# EAGLE schematic BEP32_12nutzen_90Grad (EAGLE 6.4), part 3 of 4
## Sheet 9 of 12
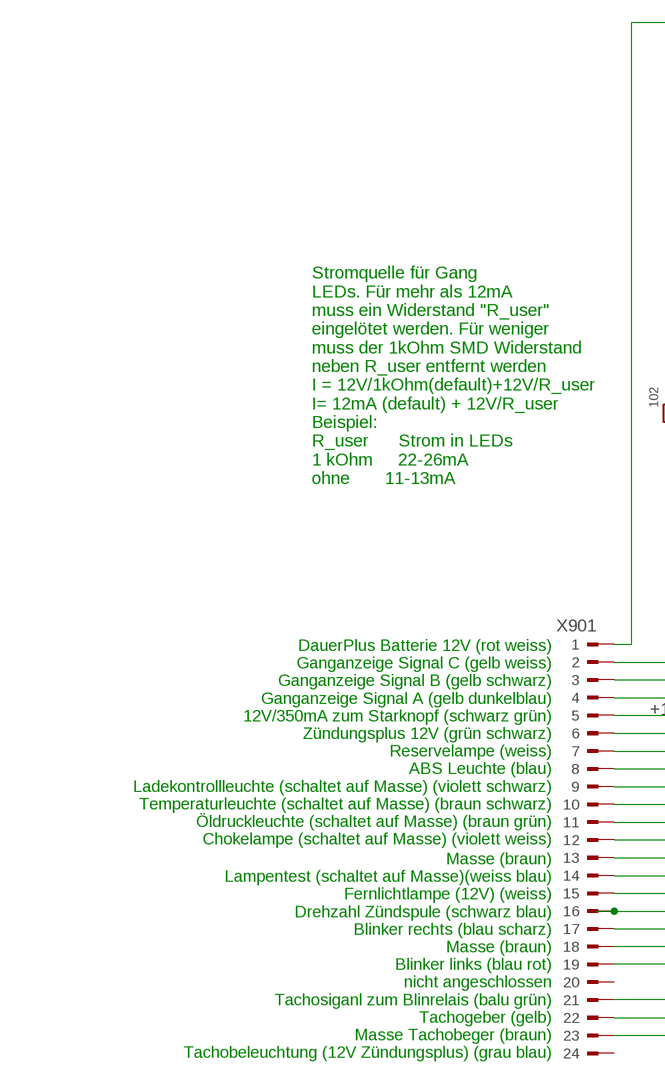
[diagram p16: schematic, sheet 9, part 1 of 2]
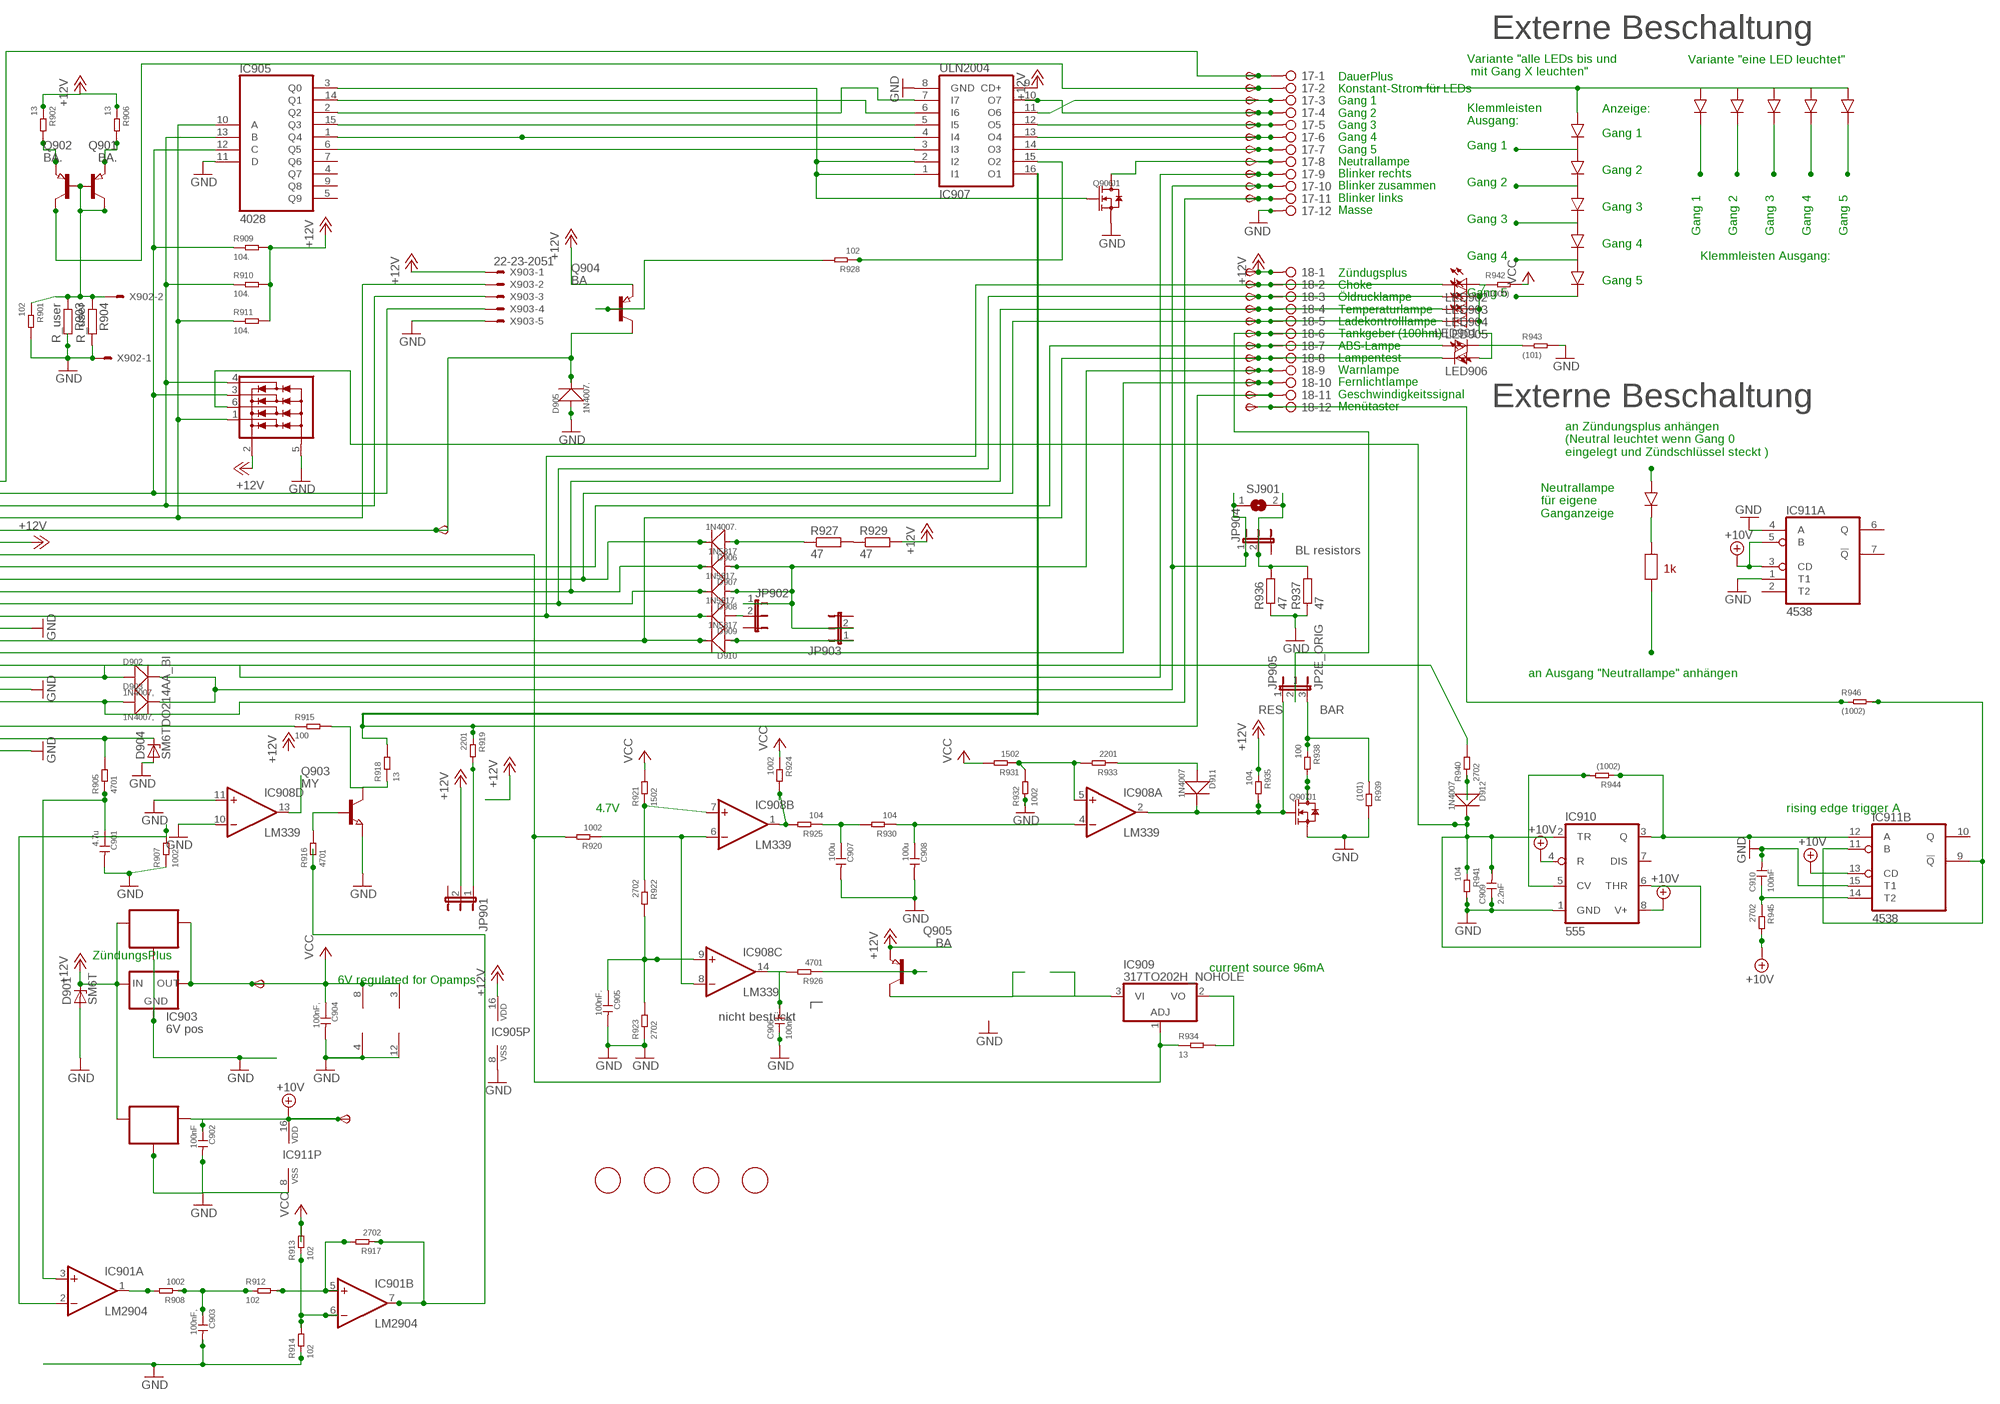
[diagram p17: schematic, sheet 9, part 2 of 2]

### Parts
6V901  TPSB2.0  [B2.0]
10V901  TPSB2.0  [B2.0]
17  2081-1132  [12-PIN]
18  2081-1132  [12-PIN]
C901  4.7u  CERAMIC-4.7UF-25V-10%-X5R(0805)  [C0805]
C902  100nF  CERAMIC-100NF-50V-10%-X7R(0805)  [C0805]
C903  100nF,  CERAMIC-100NF-50V-10%-X7R(0805)  [C0805]
C904  100nF,  CERAMIC-100NF-50V-10%-X7R(0805)  [C0805]
C905  100nF.  CERAMIC-100NF-50V-10%-X7R(0805)  [C0805]
C906  100nF.  CERAMIC-100NF-50V-10%-X7R(0805)  [C0805]
C907  100u  CERAMIC-100UF-6.3V-20%-X5R(1206)  [C1206]
C908  100u  CERAMIC-100UF-6.3V-20%-X5R(1206)  [C1206]
C909  2.2nF  CERAMIC-100NF-50V-10%-X7R(0805)  [C0805]
C910  100nF  CERAMIC-100NF-50V-10%-X7R(0805)  [C0805]
D901  SM6T  [DO214AA]
D902  1N4007,  DIODE-GEN-PURPOSE-1KV-1A(DO-214AC)  [DO-214AC]
D903  1N4007,  DIODE-GEN-PURPOSE-1KV-1A(DO-214AC)  [DO-214AC]
D904  SM6TDO214AA_BI  [DO214AA_BI]
D905  1N4007.  DIODE-GEN-PURPOSE-1KV-1A(DO-214AC)  [DO-214AC]
D906  1N4007.  DIODE-GEN-PURPOSE-1KV-1A(DO-214AC)  [DO-214AC]
D907  1N5817  DIODE-GEN-PURPOSE-1KV-1A(DO-214AC)DO-214AC/1206  [DO-214AC_SLIM]
D908  1N5817.  DIODE-GEN-PURPOSE-1KV-1A(DO-214AC)DO-214AC/1206  [DO-214AC_SLIM]
D909  1N5817.  DIODE-GEN-PURPOSE-1KV-1A(DO-214AC)DO-214AC/1206  [DO-214AC_SLIM]
D910  1N5817  DIODE-GEN-PURPOSE-1KV-1A(DO-214AC)DO-214AC/1206  [DO-214AC_SLIM]
D911  1N4007  DIODE-GEN-PURPOSE-1KV-1A(DO-214AC)  [DO-214AC]
D912  1N4007  DIODE-GEN-PURPOSE-1KV-1A(DO-214AC)  [DO-214AC]
FID901  FIDUCIAL  [FIDUCIAL_1MM]
FID902  FIDUCIAL  [FIDUCIAL_1MM]
FID903  FIDUCIAL  [FIDUCIAL_1MM]
FID904  FIDUCIAL  [FIDUCIAL_1MM]
IC901  LM2904  LM358D  [SO08]
IC902  78L06  78LXXSOT89_ROUND  [SOT89_ROUND]
IC903  6V pos  78LXX  [78LXX]
IC904  78L10  78LXXSOT89_ROUND  [SOT89_ROUND]
IC905  4028  4028D  [SO16]
IC906  NUP4304SOT457_R  [SOT457R_PHILIPS]
IC907  ULN2004  ULN2004AD  [SO16]
IC908  LM339  LM339D  [SO14]
IC909  317TO202H_NOHOLE  [TO220H_NOHOLE]
IC910  555  NE555D  [SO08]
IC911  4538  4538D  [SO16]
JP901  JP2EJP2_SMALLPADS  [JP2_SMALLPADS]
JP902  JP2EJP2_SMALLPADS  [JP2_SMALLPADS]
JP903  JP2EJP2_SMALLPADS  [JP2_SMALLPADS]
JP904  JP2EJP2_SMALLPADS  [JP2_SMALLPADS]
JP905  JP2E_ORIG  [JP2_ORIG_SMALLPADS]
LED901  LEDLD260  [LD260]
LED902  LEDLD260  [LD260]
LED903  LEDLD260  [LD260]
LED904  LEDLD260  [LD260]
LED905  LEDLD260  [LD260]
LED906  LEDLD260  [LD260]
Q901  BA.  PNP-TRANSISTOR_SOT89  [SOT89]
Q902  BA.  PNP-TRANSISTOR_SOT89  [SOT89]
Q903  MY  NPN-TRANSISTOR_SOT89  [SOT89]
Q904  BA  PNP-TRANSISTOR_SOT89  [SOT89]
Q905  BA  PNP-TRANSISTOR_SOT89  [SOT89]
Q906  J1  SMD-MOSFET-N-CH-50V-200MA-BSS138W-7-F(SOT-23)  [SOT-23]
Q907  J1  SMD-MOSFET-N-CH-50V-200MA-BSS138W-7-F(SOT-23)  [SOT-23]
R901  102  SMD-RES-1K-5%-1/8W(0805)  [R0805]
R902  13  SMD-RES-13R-5%-1/4W(1206)  [R1206]
R903  R_user  R-EU_R0805  [R0805]
R904  R_user  R-EU_R0805  [R0805]
R905  4701  SMD-RES-4.7K-5%-1/8W(0805)  [R0805]
R906  13  SMD-RES-13R-5%-1/4W(1206)  [R1206]
R907  1002  SMD-RES-10K-1%-1/8W(0805)  [R0805]
R908  1002  SMD-RES-10K-1%-1/8W(0805)  [R0805]
R909  104.  SMD-RES-10K-1%-1/8W(0805)  [R0805]
R910  104.  SMD-RES-10K-1%-1/8W(0805)  [R0805]
R911  104.  SMD-RES-10K-1%-1/8W(0805)  [R0805]
R912  102  SMD-RES-1K-5%-1/8W(0805)  [R0805]
R913  102  SMD-RES-1K-5%-1/8W(0805)  [R0805]
R914  102  SMD-RES-1K-5%-1/8W(0805)  [R0805]
R915  100  SMD-RES-220R-5%-1/8W(0805)  [R0805]
R916  4701  SMD-RES-4.7K-5%-1/8W(0805)  [R0805]
R917  2702  SMD-RES-4.7K-5%-1/8W(0805)  [R0805]
R918  13  SMD-RES-13R-5%-1/4W(1206)  [R1206]
R919  2201  SMD-RES-2.2K-5%-1/8W(0805)  [R0805]
R920  1002  SMD-RES-10K-1%-1/8W(0805)  [R0805]
R921  1502  SMD-RES-10K-1%-1/8W(0805)  [R0805]
R922  2702  SMD-RES-4.7K-5%-1/8W(0805)  [R0805]
R923  2702  SMD-RES-4.7K-5%-1/8W(0805)  [R0805]
R924  1002  SMD-RES-10K-1%-1/8W(0805)  [R0805]
R925  104  SMD-RES-10K-1%-1/8W(0805)  [R0805]
R926  4701  SMD-RES-4.7K-5%-1/8W(0805)  [R0805]
R927  47  R-EU_V235/17_1MM  [V235/17_1MM]
R928  102  SMD-RES-1K-5%-1/8W(0805)  [R0805]
R929  47  R-EU_V235/17_1MM  [V235/17_1MM]
R930  104  SMD-RES-10K-1%-1/8W(0805)  [R0805]
R931  1502  SMD-RES-10K-1%-1/8W(0805)  [R0805]
R932  1002  SMD-RES-10K-1%-1/8W(0805)  [R0805]
R933  2201  SMD-RES-2.2K-5%-1/8W(0805)  [R0805]
R934  13  SMD-RES-13R-5%-1/4W(1206)  [R1206]
R935  104.  SMD-RES-10K-1%-1/8W(0805)  [R0805]
R936  47  R-EU_V235/17_1MM  [V235/17_1MM]
R937  47  R-EU_V235/17_1MM  [V235/17_1MM]
R938  100  SMD-RES-2.2K-5%-1/8W(0805)  [R0805]
R939  (101)  SMD-RES-2.2K-5%-1/8W(0805)  [R0805]
R940  2702  SMD-RES-10K-1%-1/8W(0805)  [R0805]
R941  104  SMD-RES-10K-1%-1/8W(0805)  [R0805]
R942  (1000)  SMD-RES-100R-5%-1/8W(0805)  [R0805]
R943  (101)  SMD-RES-100R-5%-1/8W(0805)  [R0805]
R944  (1002)  SMD-RES-10K-1%-1/8W(0805)  [R0805]
R945  2702  SMD-RES-4.7K-5%-1/8W(0805)  [R0805]
R946  (1002)  SMD-RES-4.7K-5%-1/8W(0805)  [R0805]
SJ901  SJ  [SJ]
START901  TPSB2.0  [B2.0]
TP185  TPSB2.0  [B2.0]
TP186  TPSB2.0  [B2.0]
TP187  TPSB2.0  [B2.0]
TP188  TPSB2.0  [B2.0]
TP189  TPSB2.0  [B2.0]
TP190  TPSB2.0  [B2.0]
TP191  TPSB2.0  [B2.0]
TP192  TPSB2.0  [B2.0]
TP193  TPSB2.0  [B2.0]
TP194  TPSB2.0  [B2.0]
TP195  TPSB2.0  [B2.0]
TP196  TPSB2.0  [B2.0]
TP197  TPSB2.0  [B2.0]
TP198  TPSB2.0  [B2.0]
TP199  TPSB2.0  [B2.0]
TP200  TPSB2.0  [B2.0]
TP201  TPSB2.0  [B2.0]
TP202  TPSB2.0  [B2.0]
TP203  TPSB1,27  [B1,27]
TP204  TPSB2.0  [B2.0]
TP205  TPSB2.0  [B2.0]
TP206  TPSB2.0  [B2.0]
TP207  TPSB2.0  [B2.0]
X901  CON_BMWV2  [24-PIN_V2]
X902  22-23-2021  [22-23-2021]
X903  22-23-2051  [22-23-2051]

### Nets
+10V: 10V901.TP(PP) C902.1 IC904.1(OUT) IC910.4(R) IC910.8(V+) IC911.3(A:CD) IC911.5(A:B) IC911.13(B:CD) IC911.16(P:VDD) R945.2 ; also sheet 1,2,3,4,5,6,7,8,10,11,12
+12V: 18.1 D901.C IC902.3(IN) IC903.IN IC904.3(IN) IC905.16(VDD) IC906.2(V+) IC907.9(CD+) JP901.2 Q904.3(E) Q905.3(E) R902.1 R906.1 R909.2 R910.2 R911.2 R929.2 R935.1 TP206.TP(PP) X901.6 X903.1 ; also sheet 1,2,3,4,5,6,7,8,10,11,12
+12V9: IC901.7(B:OUT) R916.1 R917.1
GND: 17.12 C901.2 C902.2 C903.2 C904.2 C905.2 C906.1 C907.2 C908.2 C909.1 C910.2 D901.A D904.A D905.1(+) IC901.4(P:V-) IC902.2(GND) IC902.2@1(GND) IC903.GND IC904.2(GND) IC904.2@1(GND) IC905.8(VSS) IC905.11(D) IC906.5(V-) IC907.8(GND) IC908.10(D:-IN) IC908.11(D:+IN) IC908.12(P:GND) IC910.1(GND) IC911.1(A:T1) IC911.4(A:A) IC911.8(P:VSS) IC911.15(B:T1) Q903.3(E) Q906.2(S) Q907.2(S) R901.2 R903.2 R904.2 R907.1 R914.1 R923.1 R932.1 R936.1 R937.1 R939.2 R941.2 R943.2 X901.13 X901.18 X901.23 X902.1 X903.5 ; also sheet 1,2,3,4,5,6,7,8,10,11,12
N$779: R927.2 R929.1
N$780: 18.9 D907.1(+) D908.1(+) JP902.1 JP903.2 TP203.TP(PP)
N$781: IC905.10(A) IC906.1(D1) R911.1 X901.4 X903.2
N$782: IC905.13(B) IC906.4(D4) R910.1 X901.3 X903.3
N$783: D905.2(-) Q904.2(C) START901.TP(PP) X901.5
N$784: IC905.12(C) IC906.3(D3) R909.1 X901.2 X903.4
N$785: 18.7 LED901.A TP201.TP(PP) X901.8
N$786: 18.2 D909.2(-) LED902.K(C) TP196.TP(PP) X901.12
N$787: 18.3 D908.2(-) LED903.K(C) TP197.TP(PP) X901.11
N$788: 18.4 D907.2(-) LED904.K(C) TP198.TP(PP) X901.10
N$789: 18.8 D910.2(-) LED906.K(C) TP202.TP(PP) X901.14
N$790: 17.9 D902.1(+) TP193.TP(PP) X901.17
N$791: 17.11 D903.1(+) TP195.TP(PP) X901.19
N$792: D904.C R905.2 X901.22
N$793: C901.1 IC901.3(A:+IN) R905.1
N$794: 18.11 IC907.16(O1) R918.2 R919.1 TP205.TP(PP)
N$795: IC908.1(B:OUT) R924.2 R925.2
N$796: C907.1 R925.1 R930.2
N$797: C908.1 IC908.4(A:-IN) R930.1
N$798: IC908.5(A:+IN) R931.1 R932.2 R933.2
N$799: D911.1(+) R933.1
N$800: C905.1 IC908.9(C:+IN) R922.2 R923.2
N$801: C906.2 IC908.14(C:OUT) R926.2
N$802: Q905.1(B) R926.1
N$803: IC905.2(Q2) IC907.7(I7)
N$804: 17.5 IC907.12(O5) TP189.TP(PP)
N$805: IC905.1(Q4) IC907.4(I4)
N$806: 17.8 Q906.3(D) TP192.TP(PP)
N$807: 18.10 TP204.TP(PP) X901.15
N$808: 18.5 D906.2(-) LED905.K(C) TP199.TP(PP) X901.9
N$809: D906.1(+) R927.1
N$810: IC905.6(Q5) IC907.3(I3)
N$811: 17.4 IC907.10(O7) TP188.TP(PP)
N$812: IC909.1(ADJ) R920.2 R934.1 X901.7
N$813: IC908.6(B:-IN) IC908.8(C:-IN) R920.1
N$814: 17.2 Q901.2(C) TP186.TP(PP)
N$815: 17.1 TP185.TP(PP) X901.1
N$829: R940.2 X901.16
N$830: IC905.15(Q3) IC907.5(I5)
N$831: 17.6 IC907.13(O4) TP190.TP(PP)
N$832: 17.7 IC907.14(O3) TP191.TP(PP)
N$833: 18.6 JP905.2 TP200.TP(PP)
N$834: LED901.K(C) R943.1
N$835: LED902.A LED903.A LED904.A LED905.A LED906.A R942.1
N$836: Q904.1(B) R928.2
N$837: IC905.3(Q0) IC907.1(I1) IC907.2(I2) Q906.1(G)
N$838: IC905.14(Q1) IC907.6(I6)
N$839: 17.3 IC907.11(O6) TP187.TP(PP)
N$840: Q901.1(B) Q902.1(B) Q902.2(C) R901.1 R903.1 R904.1 X902.2
N$841: Q901.3(E) R902.2
N$842: Q902.3(E) R906.2
N$843: IC908.7(B:+IN) R921.1 R922.1
N$844: IC901.2(A:-IN) R907.2
N$845: Q903.1(B) R916.2
N$846: Q907.3(D) R938.2
N$847: IC909.2(VO) R934.2
N$848: IC909.3(VI) Q905.2(C)
N$849: C909.2 D912.2(-) IC906.6(D2) IC910.2(TR) IC910.6(THR) R941.1
N$850: IC910.5(CV) R944.2
N$851: IC910.3(Q) IC911.12(B:A) R944.1
N$852: D912.1(+) R940.1
N$853: 17.10 D902.2(-) D903.2(-) JP904.1 SJ901.1 TP194.TP(PP)
N$854: JP904.2 R936.2 R937.2 SJ901.2
N$855: IC911.9(B:!Q) IC911.11(B:B) R946.2
N$856: C910.1 IC911.14(B:T2) R945.1
N$857: JP901.1 R919.2
N$858: IC907.15(O2) R928.1
N$859: 18.12 R946.1 TP207.TP(PP)
N$860: D909.1(+) JP902.2
N$861: D911.2(-) IC908.2(A:OUT) JP905.1 Q907.1(G) R935.2
N$862: IC901.1(A:OUT) R908.2
N$863: C903.1 R908.1 R912.1
N$864: IC901.5(B:+IN) R912.2 R917.2
N$865: IC901.6(B:-IN) R913.1 R914.2
N$866: D910.1(+) JP903.1
N$867: JP905.3 R938.1 R939.1
N$868: IC908.13(D:OUT)
N$869: R915.1 X901.21
N$870: Q903.2(C) R915.2 R918.1
VCC: 6V901.TP(PP) C904.1 IC901.8(P:V+) IC902.1(OUT) IC903.OUT IC908.3(P:V+) R913.2 R921.2 R924.1 R931.2 R942.2 ; also sheet 1,2,3,4,5,6,7,8,10,11,12
Unconnected: IC905.4(Q7) IC905.5(Q9) IC905.7(Q6) IC905.9(Q8) IC910.7(DIS) IC911.2(A:T2) IC911.6(A:Q) IC911.7(A:!Q) IC911.10(B:Q) X901.20 X901.24

### Notes on the sheet
- Externe Beschaltung
- Variante "eine LED leuchtet"
- Variante "alle LEDs bis und
   mit Gang X leuchten"
- Anzeige:
- Klemmleisten
  Ausgang:
- Gang 1
- DauerPlus
  Konstant-Strom für LEDs
  Gang 1
  Gang 2
  Gang 3
  Gang 4
  Gang 5
  Neutrallampe
  Blinker rechts
  Blinker zusammen
  Blinker links
  Masse
- Gang 1
- Gang 2
- Gang 2
- Gang 3
- Gang 3
- Gang 1 | Gang 2 | Gang 3 | Gang 4 | Gang 5
- Gang 4
- Gang 4 | Klemmleisten Ausgang:
- Gang 5
- Gang 5
- Zündugsplus
  Choke
  Öldrucklampe
  Temperaturlampe
  Ladekontrolllampe
  Tankgeber (100hm)
  ABS-Lampe
  Lampentest
  Warnlampe
  Fernlichtlampe
  Geschwindigkeitssignal
  Menütaster
- Stromquelle für Gang
  LEDs. Für mehr als 12mA
  muss ein Widerstand "R_user"
  eingelötet werden. Für weniger
  muss der 1kOhm SMD Widerstand
  neben R_user entfernt werden
  I = 12V/1kOhm(default)+12V/R_user
  I= 12mA (default) + 12V/R_user
  Beispiel:
  R_user      Strom in LEDs
  1 kOhm     22-26mA
  ohne       11-13mA
- Externe Beschaltung
- an Zündungsplus anhängen
  (Neutral leuchtet wenn Gang 0
  eingelegt und Zündschlüssel steckt )
- Neutrallampe
  für eigene
  Ganganzeige
- DauerPlus Batterie 12V (rot weiss)
  Ganganzeige Signal C (gelb weiss)
  Ganganzeige Signal B (gelb schwarz)
  Ganganzeige Signal A (gelb dunkelblau)
  12V/350mA zum Starknopf (schwarz grün)
  Zündungsplus 12V (grün schwarz)
  Reservelampe (weiss)
  ABS Leuchte (blau)
  Ladekontrollleuchte (schaltet auf Masse) (violett schwarz)
  Temperaturleuchte (schaltet auf Masse) (braun schwarz)
  Öldruckleuchte (schaltet auf Masse) (braun grün)
  Chokelampe (schaltet auf Masse) (violett weiss)
- BL resistors
- 1k
- an Ausgang "Neutrallampe" anhängen
- Masse (braun)
  Lampentest (schaltet auf Masse)(weiss blau)
  Fernlichtlampe (12V) (weiss)
  Drehzahl Zündspule (schwarz blau)
  Blinker rechts (blau scharz)
  Masse (braun)
  Blinker links (blau rot)
  nicht angeschlossen
  Tachosiganl zum Blinrelais (balu grün)
  Tachogeber (gelb)
  Masse Tachobeger (braun)
  Tachobeleuchtung (12V Zündungsplus) (grau blau)
- RES | BAR
- 4.7V | rising edge trigger A
- ZündungsPlus
- current source 96mA
- 6V regulated for Opamps
- nicht bestückt

## Sheet 10 of 12
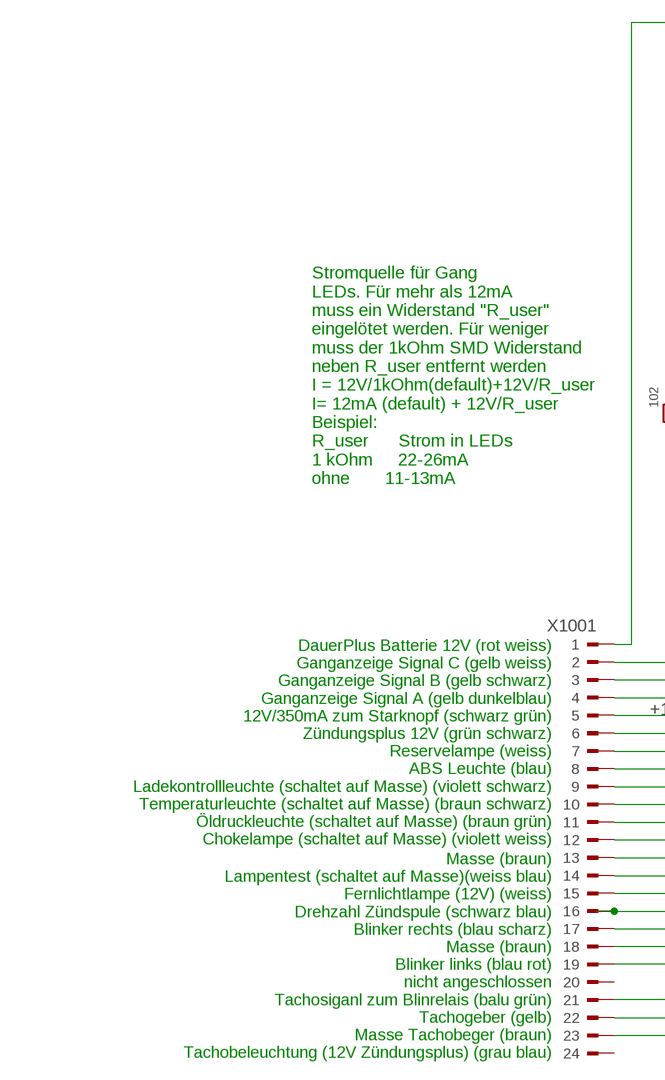
[diagram p18: schematic, sheet 10, part 1 of 2]
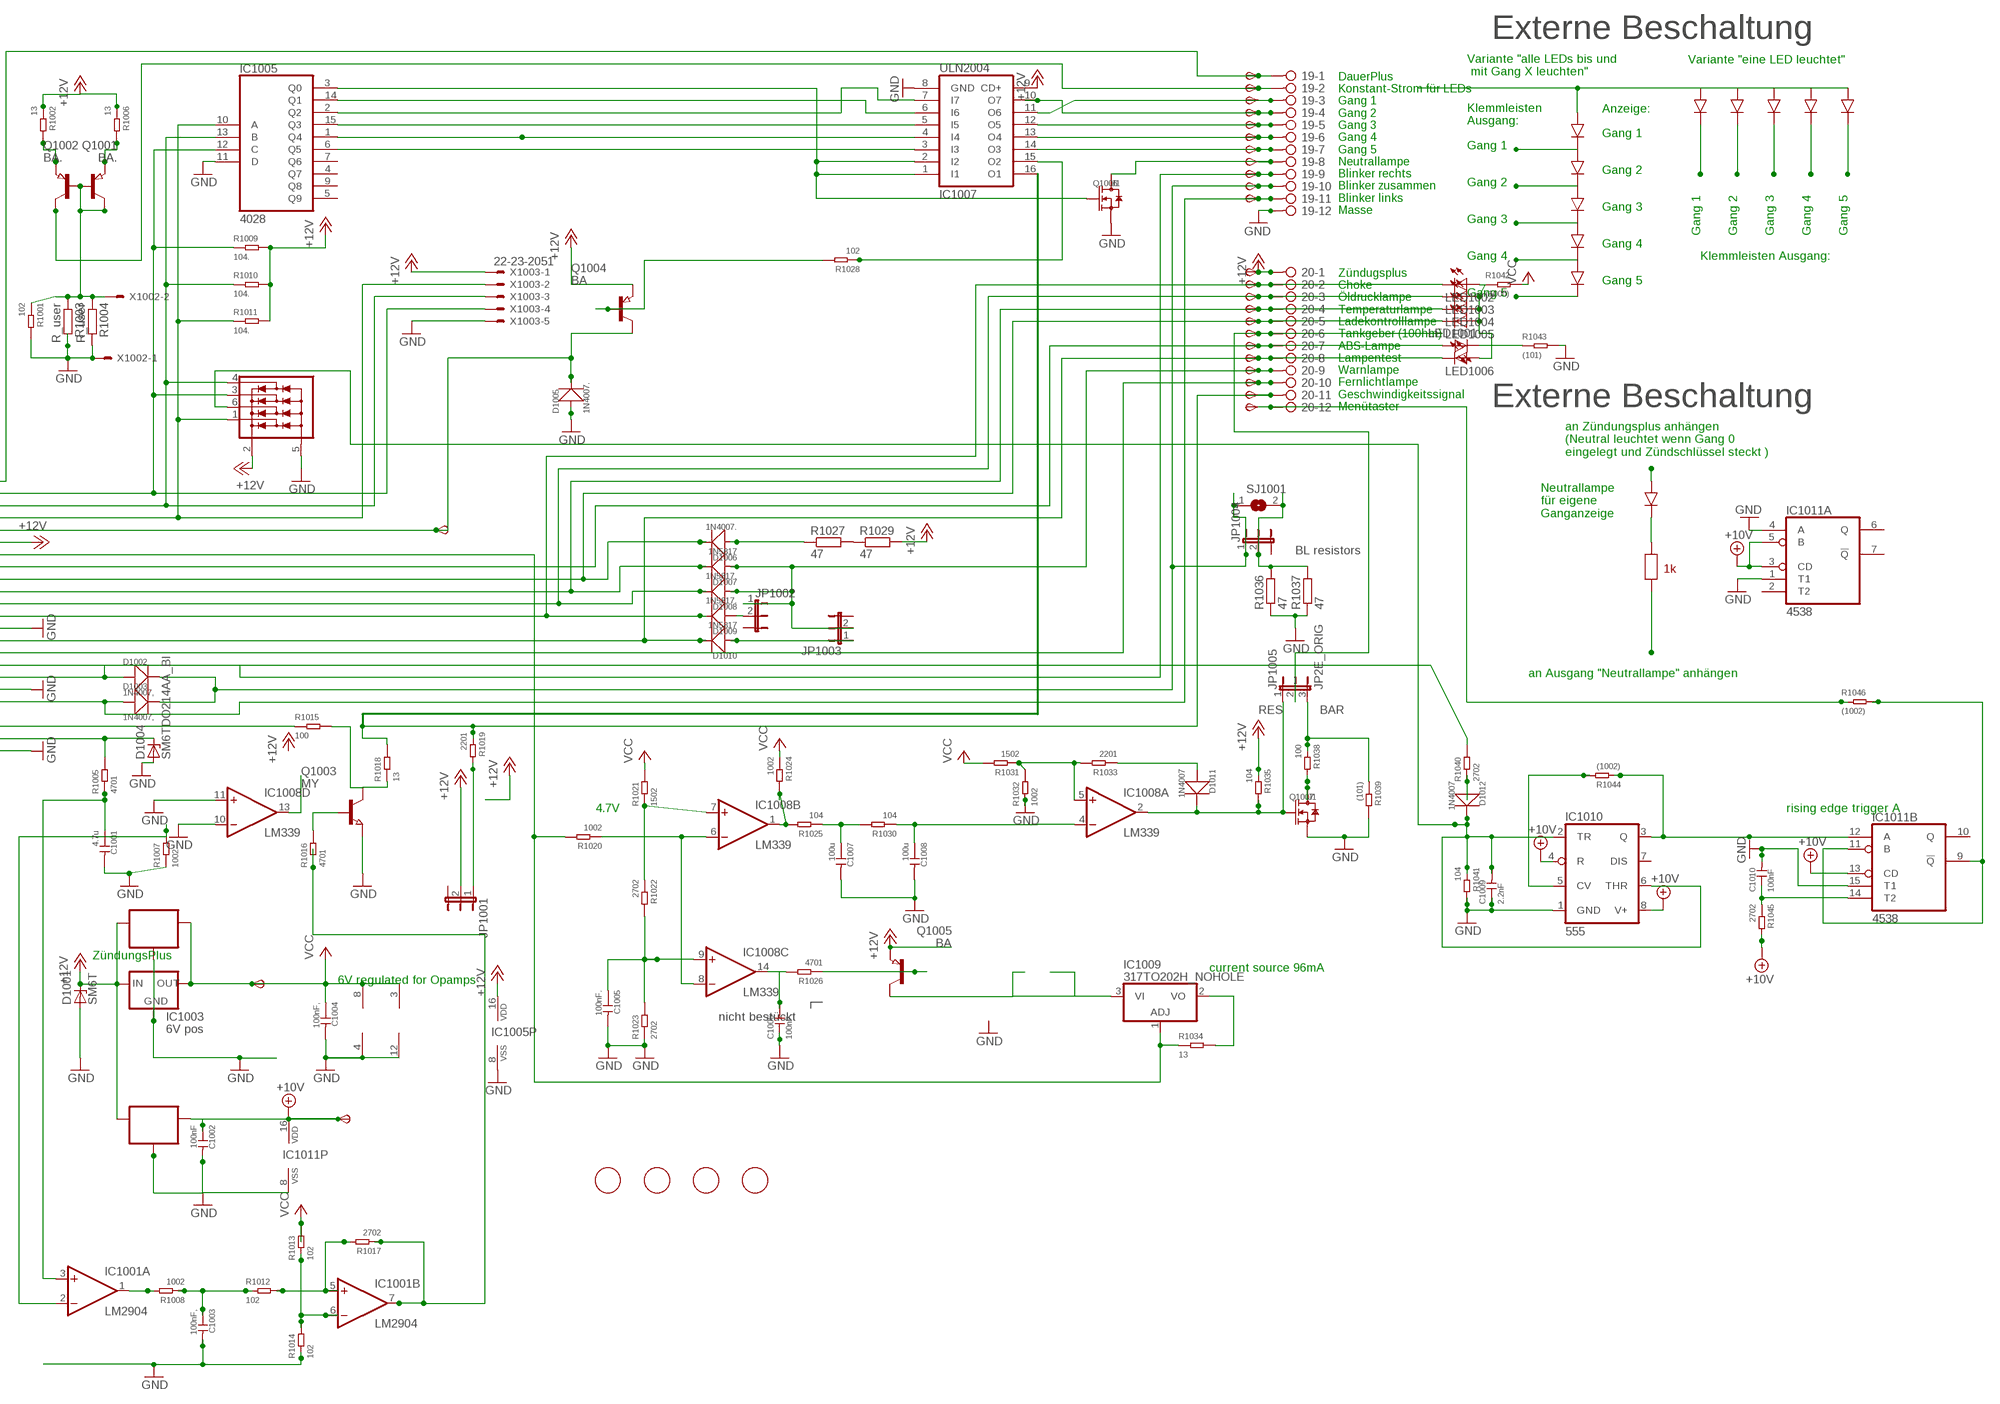
[diagram p19: schematic, sheet 10, part 2 of 2]

### Parts
6V1001  TPSB2.0  [B2.0]
10V1001  TPSB2.0  [B2.0]
19  2081-1132  [12-PIN]
20  2081-1132  [12-PIN]
C1001  4.7u  CERAMIC-4.7UF-25V-10%-X5R(0805)  [C0805]
C1002  100nF  CERAMIC-100NF-50V-10%-X7R(0805)  [C0805]
C1003  100nF,  CERAMIC-100NF-50V-10%-X7R(0805)  [C0805]
C1004  100nF,  CERAMIC-100NF-50V-10%-X7R(0805)  [C0805]
C1005  100nF.  CERAMIC-100NF-50V-10%-X7R(0805)  [C0805]
C1006  100nF.  CERAMIC-100NF-50V-10%-X7R(0805)  [C0805]
C1007  100u  CERAMIC-100UF-6.3V-20%-X5R(1206)  [C1206]
C1008  100u  CERAMIC-100UF-6.3V-20%-X5R(1206)  [C1206]
C1009  2.2nF  CERAMIC-100NF-50V-10%-X7R(0805)  [C0805]
C1010  100nF  CERAMIC-100NF-50V-10%-X7R(0805)  [C0805]
D1001  SM6T  [DO214AA]
D1002  1N4007,  DIODE-GEN-PURPOSE-1KV-1A(DO-214AC)  [DO-214AC]
D1003  1N4007,  DIODE-GEN-PURPOSE-1KV-1A(DO-214AC)  [DO-214AC]
D1004  SM6TDO214AA_BI  [DO214AA_BI]
D1005  1N4007.  DIODE-GEN-PURPOSE-1KV-1A(DO-214AC)  [DO-214AC]
D1006  1N4007.  DIODE-GEN-PURPOSE-1KV-1A(DO-214AC)  [DO-214AC]
D1007  1N5817  DIODE-GEN-PURPOSE-1KV-1A(DO-214AC)DO-214AC/1206  [DO-214AC_SLIM]
D1008  1N5817.  DIODE-GEN-PURPOSE-1KV-1A(DO-214AC)DO-214AC/1206  [DO-214AC_SLIM]
D1009  1N5817.  DIODE-GEN-PURPOSE-1KV-1A(DO-214AC)DO-214AC/1206  [DO-214AC_SLIM]
D1010  1N5817  DIODE-GEN-PURPOSE-1KV-1A(DO-214AC)DO-214AC/1206  [DO-214AC_SLIM]
D1011  1N4007  DIODE-GEN-PURPOSE-1KV-1A(DO-214AC)  [DO-214AC]
D1012  1N4007  DIODE-GEN-PURPOSE-1KV-1A(DO-214AC)  [DO-214AC]
FID1001  FIDUCIAL  [FIDUCIAL_1MM]
FID1002  FIDUCIAL  [FIDUCIAL_1MM]
FID1003  FIDUCIAL  [FIDUCIAL_1MM]
FID1004  FIDUCIAL  [FIDUCIAL_1MM]
IC1001  LM2904  LM358D  [SO08]
IC1002  78L06  78LXXSOT89_ROUND  [SOT89_ROUND]
IC1003  6V pos  78LXX  [78LXX]
IC1004  78L10  78LXXSOT89_ROUND  [SOT89_ROUND]
IC1005  4028  4028D  [SO16]
IC1006  NUP4304SOT457_R  [SOT457R_PHILIPS]
IC1007  ULN2004  ULN2004AD  [SO16]
IC1008  LM339  LM339D  [SO14]
IC1009  317TO202H_NOHOLE  [TO220H_NOHOLE]
IC1010  555  NE555D  [SO08]
IC1011  4538  4538D  [SO16]
JP1001  JP2EJP2_SMALLPADS  [JP2_SMALLPADS]
JP1002  JP2EJP2_SMALLPADS  [JP2_SMALLPADS]
JP1003  JP2EJP2_SMALLPADS  [JP2_SMALLPADS]
JP1004  JP2EJP2_SMALLPADS  [JP2_SMALLPADS]
JP1005  JP2E_ORIG  [JP2_ORIG_SMALLPADS]
LED1001  LEDLD260  [LD260]
LED1002  LEDLD260  [LD260]
LED1003  LEDLD260  [LD260]
LED1004  LEDLD260  [LD260]
LED1005  LEDLD260  [LD260]
LED1006  LEDLD260  [LD260]
Q1001  BA.  PNP-TRANSISTOR_SOT89  [SOT89]
Q1002  BA.  PNP-TRANSISTOR_SOT89  [SOT89]
Q1003  MY  NPN-TRANSISTOR_SOT89  [SOT89]
Q1004  BA  PNP-TRANSISTOR_SOT89  [SOT89]
Q1005  BA  PNP-TRANSISTOR_SOT89  [SOT89]
Q1006  J1  SMD-MOSFET-N-CH-50V-200MA-BSS138W-7-F(SOT-23)  [SOT-23]
Q1007  J1  SMD-MOSFET-N-CH-50V-200MA-BSS138W-7-F(SOT-23)  [SOT-23]
R1001  102  SMD-RES-1K-5%-1/8W(0805)  [R0805]
R1002  13  SMD-RES-13R-5%-1/4W(1206)  [R1206]
R1003  R_user  R-EU_R0805  [R0805]
R1004  R_user  R-EU_R0805  [R0805]
R1005  4701  SMD-RES-4.7K-5%-1/8W(0805)  [R0805]
R1006  13  SMD-RES-13R-5%-1/4W(1206)  [R1206]
R1007  1002  SMD-RES-10K-1%-1/8W(0805)  [R0805]
R1008  1002  SMD-RES-10K-1%-1/8W(0805)  [R0805]
R1009  104.  SMD-RES-10K-1%-1/8W(0805)  [R0805]
R1010  104.  SMD-RES-10K-1%-1/8W(0805)  [R0805]
R1011  104.  SMD-RES-10K-1%-1/8W(0805)  [R0805]
R1012  102  SMD-RES-1K-5%-1/8W(0805)  [R0805]
R1013  102  SMD-RES-1K-5%-1/8W(0805)  [R0805]
R1014  102  SMD-RES-1K-5%-1/8W(0805)  [R0805]
R1015  100  SMD-RES-220R-5%-1/8W(0805)  [R0805]
R1016  4701  SMD-RES-4.7K-5%-1/8W(0805)  [R0805]
R1017  2702  SMD-RES-4.7K-5%-1/8W(0805)  [R0805]
R1018  13  SMD-RES-13R-5%-1/4W(1206)  [R1206]
R1019  2201  SMD-RES-2.2K-5%-1/8W(0805)  [R0805]
R1020  1002  SMD-RES-10K-1%-1/8W(0805)  [R0805]
R1021  1502  SMD-RES-10K-1%-1/8W(0805)  [R0805]
R1022  2702  SMD-RES-4.7K-5%-1/8W(0805)  [R0805]
R1023  2702  SMD-RES-4.7K-5%-1/8W(0805)  [R0805]
R1024  1002  SMD-RES-10K-1%-1/8W(0805)  [R0805]
R1025  104  SMD-RES-10K-1%-1/8W(0805)  [R0805]
R1026  4701  SMD-RES-4.7K-5%-1/8W(0805)  [R0805]
R1027  47  R-EU_V235/17_1MM  [V235/17_1MM]
R1028  102  SMD-RES-1K-5%-1/8W(0805)  [R0805]
R1029  47  R-EU_V235/17_1MM  [V235/17_1MM]
R1030  104  SMD-RES-10K-1%-1/8W(0805)  [R0805]
R1031  1502  SMD-RES-10K-1%-1/8W(0805)  [R0805]
R1032  1002  SMD-RES-10K-1%-1/8W(0805)  [R0805]
R1033  2201  SMD-RES-2.2K-5%-1/8W(0805)  [R0805]
R1034  13  SMD-RES-13R-5%-1/4W(1206)  [R1206]
R1035  104  SMD-RES-10K-1%-1/8W(0805)  [R0805]
R1036  47  R-EU_V235/17_1MM  [V235/17_1MM]
R1037  47  R-EU_V235/17_1MM  [V235/17_1MM]
R1038  100  SMD-RES-2.2K-5%-1/8W(0805)  [R0805]
R1039  (101)  SMD-RES-2.2K-5%-1/8W(0805)  [R0805]
R1040  2702  SMD-RES-10K-1%-1/8W(0805)  [R0805]
R1041  104  SMD-RES-10K-1%-1/8W(0805)  [R0805]
R1042  (1000)  SMD-RES-100R-5%-1/8W(0805)  [R0805]
R1043  (101)  SMD-RES-100R-5%-1/8W(0805)  [R0805]
R1044  (1002)  SMD-RES-10K-1%-1/8W(0805)  [R0805]
R1045  2702  SMD-RES-4.7K-5%-1/8W(0805)  [R0805]
R1046  (1002)  SMD-RES-4.7K-5%-1/8W(0805)  [R0805]
SJ1001  SJ  [SJ]
START1001  TPSB2.0  [B2.0]
TP208  TPSB2.0  [B2.0]
TP209  TPSB2.0  [B2.0]
TP210  TPSB2.0  [B2.0]
TP211  TPSB2.0  [B2.0]
TP212  TPSB2.0  [B2.0]
TP213  TPSB2.0  [B2.0]
TP214  TPSB2.0  [B2.0]
TP215  TPSB2.0  [B2.0]
TP216  TPSB2.0  [B2.0]
TP217  TPSB2.0  [B2.0]
TP218  TPSB2.0  [B2.0]
TP219  TPSB2.0  [B2.0]
TP220  TPSB2.0  [B2.0]
TP221  TPSB2.0  [B2.0]
TP222  TPSB2.0  [B2.0]
TP223  TPSB2.0  [B2.0]
TP224  TPSB2.0  [B2.0]
TP225  TPSB2.0  [B2.0]
TP226  TPSB1,27  [B1,27]
TP227  TPSB2.0  [B2.0]
TP228  TPSB2.0  [B2.0]
TP229  TPSB2.0  [B2.0]
TP230  TPSB2.0  [B2.0]
X1001  CON_BMWV2  [24-PIN_V2]
X1002  22-23-2021  [22-23-2021]
X1003  22-23-2051  [22-23-2051]

### Nets
+10V: 10V1001.TP(PP) C1002.1 IC1004.1(OUT) IC1010.4(R) IC1010.8(V+) IC1011.3(A:CD) IC1011.5(A:B) IC1011.13(B:CD) IC1011.16(P:VDD) R1045.2 ; also sheet 1,2,3,4,5,6,7,8,9,11,12
+12V: 20.1 D1001.C IC1002.3(IN) IC1003.IN IC1004.3(IN) IC1005.16(VDD) IC1006.2(V+) IC1007.9(CD+) JP1001.2 Q1004.3(E) Q1005.3(E) R1002.1 R1006.1 R1009.2 R1010.2 R1011.2 R1029.2 R1035.1 TP229.TP(PP) X1001.6 X1003.1 ; also sheet 1,2,3,4,5,6,7,8,9,11,12
+12V10: IC1001.7(B:OUT) R1016.1 R1017.1
GND: 19.12 C1001.2 C1002.2 C1003.2 C1004.2 C1005.2 C1006.1 C1007.2 C1008.2 C1009.1 C1010.2 D1001.A D1004.A D1005.1(+) IC1001.4(P:V-) IC1002.2(GND) IC1002.2@1(GND) IC1003.GND IC1004.2(GND) IC1004.2@1(GND) IC1005.8(VSS) IC1005.11(D) IC1006.5(V-) IC1007.8(GND) IC1008.10(D:-IN) IC1008.11(D:+IN) IC1008.12(P:GND) IC1010.1(GND) IC1011.1(A:T1) IC1011.4(A:A) IC1011.8(P:VSS) IC1011.15(B:T1) Q1003.3(E) Q1006.2(S) Q1007.2(S) R1001.2 R1003.2 R1004.2 R1007.1 R1014.1 R1023.1 R1032.1 R1036.1 R1037.1 R1039.2 R1041.2 R1043.2 X1001.13 X1001.18 X1001.23 X1002.1 X1003.5 ; also sheet 1,2,3,4,5,6,7,8,9,11,12
N$892: R1027.2 R1029.1
N$893: 20.9 D1007.1(+) D1008.1(+) JP1002.1 JP1003.2 TP226.TP(PP)
N$894: IC1005.10(A) IC1006.1(D1) R1011.1 X1001.4 X1003.2
N$895: IC1005.13(B) IC1006.4(D4) R1010.1 X1001.3 X1003.3
N$896: D1005.2(-) Q1004.2(C) START1001.TP(PP) X1001.5
N$897: IC1005.12(C) IC1006.3(D3) R1009.1 X1001.2 X1003.4
N$898: 20.7 LED1001.A TP224.TP(PP) X1001.8
N$899: 20.2 D1009.2(-) LED1002.K(C) TP219.TP(PP) X1001.12
N$900: 20.3 D1008.2(-) LED1003.K(C) TP220.TP(PP) X1001.11
N$901: 20.4 D1007.2(-) LED1004.K(C) TP221.TP(PP) X1001.10
N$902: 20.8 D1010.2(-) LED1006.K(C) TP225.TP(PP) X1001.14
N$903: 19.9 D1002.1(+) TP216.TP(PP) X1001.17
N$904: 19.11 D1003.1(+) TP218.TP(PP) X1001.19
N$905: D1004.C R1005.2 X1001.22
N$906: C1001.1 IC1001.3(A:+IN) R1005.1
N$907: 20.11 IC1007.16(O1) R1018.2 R1019.1 TP228.TP(PP)
N$908: IC1008.1(B:OUT) R1024.2 R1025.2
N$909: C1007.1 R1025.1 R1030.2
N$910: C1008.1 IC1008.4(A:-IN) R1030.1
N$911: IC1008.5(A:+IN) R1031.1 R1032.2 R1033.2
N$912: D1011.1(+) R1033.1
N$913: C1005.1 IC1008.9(C:+IN) R1022.2 R1023.2
N$914: C1006.2 IC1008.14(C:OUT) R1026.2
N$915: Q1005.1(B) R1026.1
N$916: IC1005.2(Q2) IC1007.7(I7)
N$917: 19.5 IC1007.12(O5) TP212.TP(PP)
N$918: IC1005.1(Q4) IC1007.4(I4)
N$919: 19.8 Q1006.3(D) TP215.TP(PP)
N$920: 20.10 TP227.TP(PP) X1001.15
N$921: 20.5 D1006.2(-) LED1005.K(C) TP222.TP(PP) X1001.9
N$922: D1006.1(+) R1027.1
N$923: IC1005.6(Q5) IC1007.3(I3)
N$924: 19.4 IC1007.10(O7) TP211.TP(PP)
N$925: IC1009.1(ADJ) R1020.2 R1034.1 X1001.7
N$926: IC1008.6(B:-IN) IC1008.8(C:-IN) R1020.1
N$927: 19.2 Q1001.2(C) TP209.TP(PP)
N$928: 19.1 TP208.TP(PP) X1001.1
N$942: R1040.2 X1001.16
N$943: IC1005.15(Q3) IC1007.5(I5)
N$944: 19.6 IC1007.13(O4) TP213.TP(PP)
N$945: 19.7 IC1007.14(O3) TP214.TP(PP)
N$946: 20.6 JP1005.2 TP223.TP(PP)
N$947: LED1001.K(C) R1043.1
N$948: LED1002.A LED1003.A LED1004.A LED1005.A LED1006.A R1042.1
N$949: Q1004.1(B) R1028.2
N$950: IC1005.3(Q0) IC1007.1(I1) IC1007.2(I2) Q1006.1(G)
N$951: IC1005.14(Q1) IC1007.6(I6)
N$952: 19.3 IC1007.11(O6) TP210.TP(PP)
N$953: Q1001.1(B) Q1002.1(B) Q1002.2(C) R1001.1 R1003.1 R1004.1 X1002.2
N$954: Q1001.3(E) R1002.2
N$955: Q1002.3(E) R1006.2
N$956: IC1008.7(B:+IN) R1021.1 R1022.1
N$957: IC1001.2(A:-IN) R1007.2
N$958: Q1003.1(B) R1016.2
N$959: Q1007.3(D) R1038.2
N$960: IC1009.2(VO) R1034.2
N$961: IC1009.3(VI) Q1005.2(C)
N$962: C1009.2 D1012.2(-) IC1006.6(D2) IC1010.2(TR) IC1010.6(THR) R1041.1
N$963: IC1010.5(CV) R1044.2
N$964: IC1010.3(Q) IC1011.12(B:A) R1044.1
N$965: D1012.1(+) R1040.1
N$966: 19.10 D1002.2(-) D1003.2(-) JP1004.1 SJ1001.1 TP217.TP(PP)
N$967: JP1004.2 R1036.2 R1037.2 SJ1001.2
N$968: IC1011.9(B:!Q) IC1011.11(B:B) R1046.2
N$969: C1010.1 IC1011.14(B:T2) R1045.1
N$970: JP1001.1 R1019.2
N$971: IC1007.15(O2) R1028.1
N$972: 20.12 R1046.1 TP230.TP(PP)
N$973: D1009.1(+) JP1002.2
N$974: D1011.2(-) IC1008.2(A:OUT) JP1005.1 Q1007.1(G) R1035.2
N$975: IC1001.1(A:OUT) R1008.2
N$976: C1003.1 R1008.1 R1012.1
N$977: IC1001.5(B:+IN) R1012.2 R1017.2
N$978: IC1001.6(B:-IN) R1013.1 R1014.2
N$979: D1010.1(+) JP1003.1
N$980: JP1005.3 R1038.1 R1039.1
N$981: IC1008.13(D:OUT)
N$982: R1015.1 X1001.21
N$983: Q1003.2(C) R1015.2 R1018.1
VCC: 6V1001.TP(PP) C1004.1 IC1001.8(P:V+) IC1002.1(OUT) IC1003.OUT IC1008.3(P:V+) R1013.2 R1021.2 R1024.1 R1031.2 R1042.2 ; also sheet 1,2,3,4,5,6,7,8,9,11,12
Unconnected: IC1005.4(Q7) IC1005.5(Q9) IC1005.7(Q6) IC1005.9(Q8) IC1010.7(DIS) IC1011.2(A:T2) IC1011.6(A:Q) IC1011.7(A:!Q) IC1011.10(B:Q) X1001.20 X1001.24

### Notes on the sheet
- Externe Beschaltung
- Variante "eine LED leuchtet"
- Variante "alle LEDs bis und
   mit Gang X leuchten"
- Anzeige:
- Klemmleisten
  Ausgang:
- Gang 1
- DauerPlus
  Konstant-Strom für LEDs
  Gang 1
  Gang 2
  Gang 3
  Gang 4
  Gang 5
  Neutrallampe
  Blinker rechts
  Blinker zusammen
  Blinker links
  Masse
- Gang 1
- Gang 2
- Gang 2
- Gang 3
- Gang 3
- Gang 1 | Gang 2 | Gang 3 | Gang 4 | Gang 5
- Gang 4
- Gang 4 | Klemmleisten Ausgang:
- Gang 5
- Gang 5
- Zündugsplus
  Choke
  Öldrucklampe
  Temperaturlampe
  Ladekontrolllampe
  Tankgeber (100hm)
  ABS-Lampe
  Lampentest
  Warnlampe
  Fernlichtlampe
  Geschwindigkeitssignal
  Menütaster
- Stromquelle für Gang
  LEDs. Für mehr als 12mA
  muss ein Widerstand "R_user"
  eingelötet werden. Für weniger
  muss der 1kOhm SMD Widerstand
  neben R_user entfernt werden
  I = 12V/1kOhm(default)+12V/R_user
  I= 12mA (default) + 12V/R_user
  Beispiel:
  R_user      Strom in LEDs
  1 kOhm     22-26mA
  ohne       11-13mA
- Externe Beschaltung
- an Zündungsplus anhängen
  (Neutral leuchtet wenn Gang 0
  eingelegt und Zündschlüssel steckt )
- Neutrallampe
  für eigene
  Ganganzeige
- DauerPlus Batterie 12V (rot weiss)
  Ganganzeige Signal C (gelb weiss)
  Ganganzeige Signal B (gelb schwarz)
  Ganganzeige Signal A (gelb dunkelblau)
  12V/350mA zum Starknopf (schwarz grün)
  Zündungsplus 12V (grün schwarz)
  Reservelampe (weiss)
  ABS Leuchte (blau)
  Ladekontrollleuchte (schaltet auf Masse) (violett schwarz)
  Temperaturleuchte (schaltet auf Masse) (braun schwarz)
  Öldruckleuchte (schaltet auf Masse) (braun grün)
  Chokelampe (schaltet auf Masse) (violett weiss)
- BL resistors
- 1k
- an Ausgang "Neutrallampe" anhängen
- Masse (braun)
  Lampentest (schaltet auf Masse)(weiss blau)
  Fernlichtlampe (12V) (weiss)
  Drehzahl Zündspule (schwarz blau)
  Blinker rechts (blau scharz)
  Masse (braun)
  Blinker links (blau rot)
  nicht angeschlossen
  Tachosiganl zum Blinrelais (balu grün)
  Tachogeber (gelb)
  Masse Tachobeger (braun)
  Tachobeleuchtung (12V Zündungsplus) (grau blau)
- RES | BAR
- 4.7V | rising edge trigger A
- ZündungsPlus
- current source 96mA
- 6V regulated for Opamps
- nicht bestückt

## Sheet 11 of 12
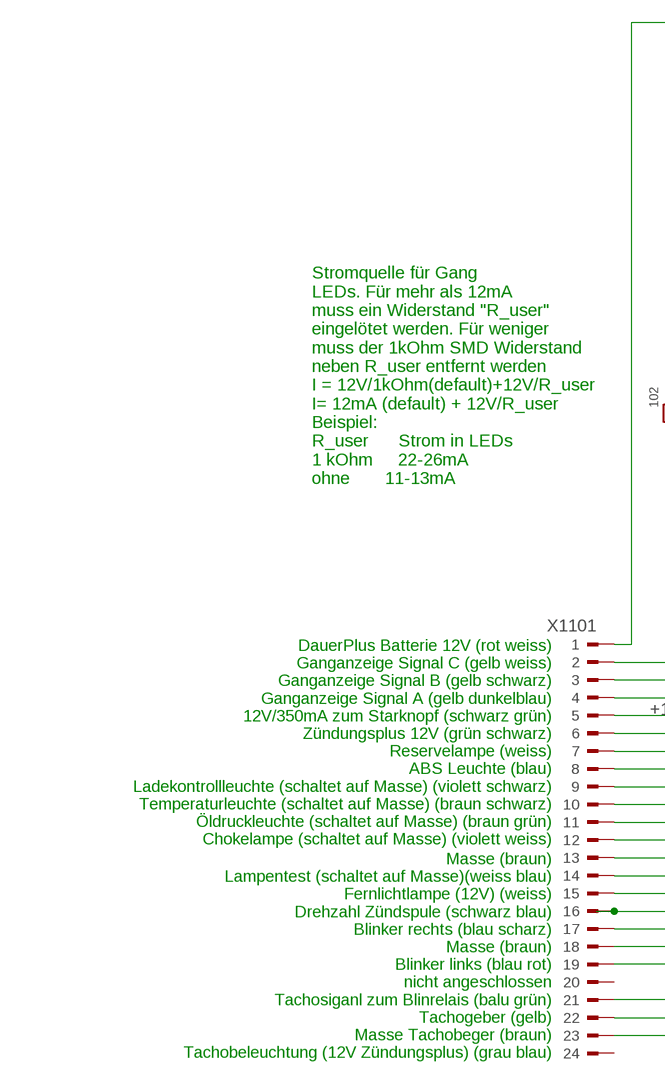
[diagram p20: schematic, sheet 11, part 1 of 2]
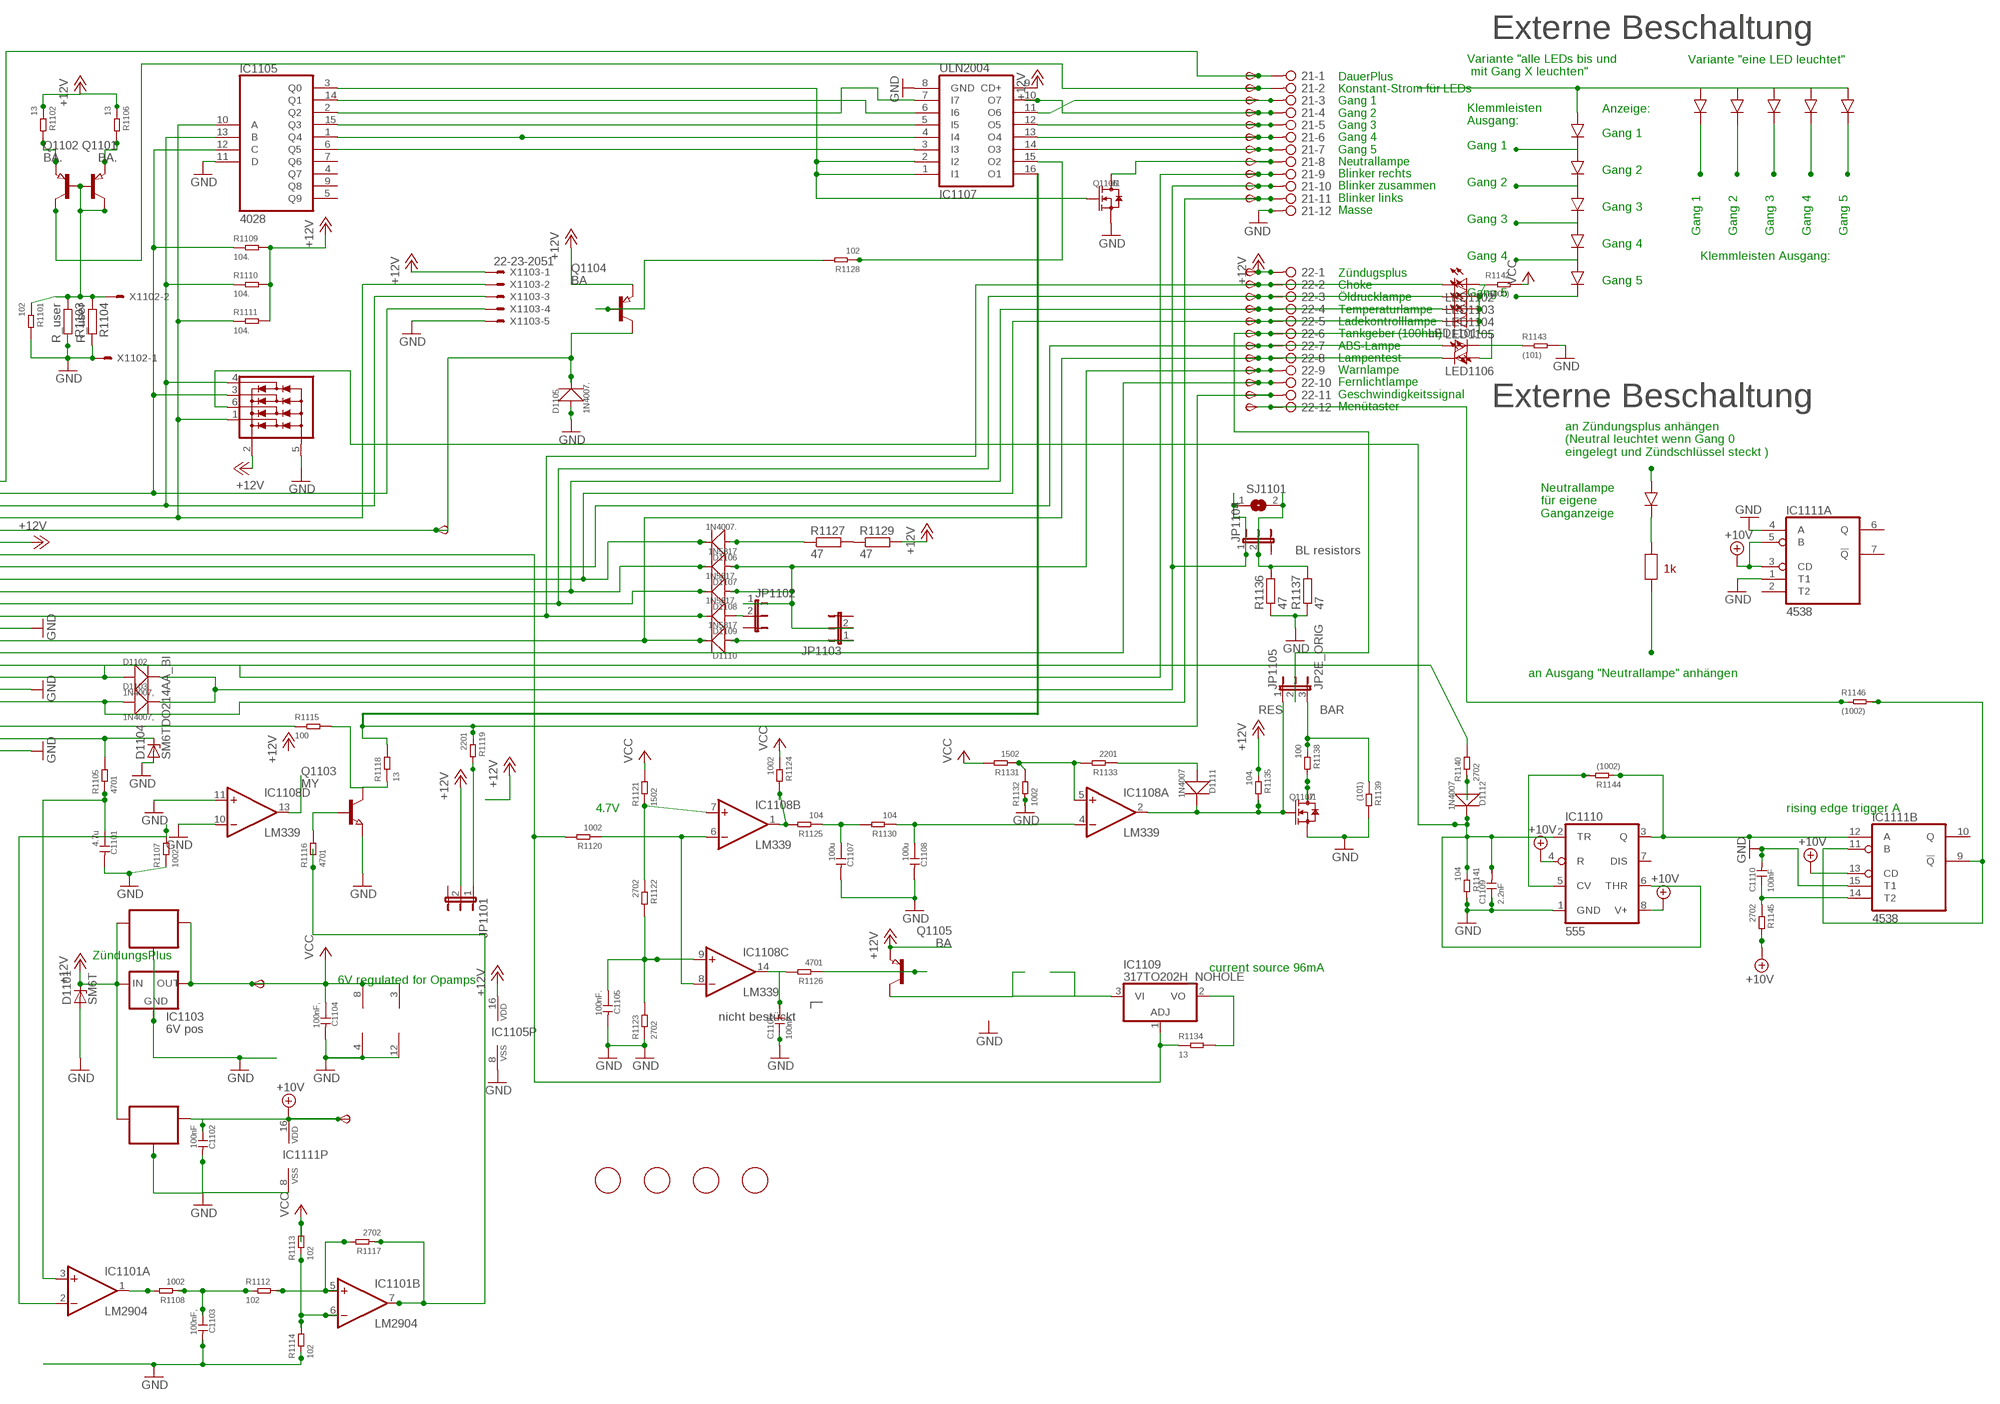
[diagram p21: schematic, sheet 11, part 2 of 2]

### Parts
6V1101  TPSB2.0  [B2.0]
10V1101  TPSB2.0  [B2.0]
21  2081-1132  [12-PIN]
22  2081-1132  [12-PIN]
C1101  4.7u  CERAMIC-4.7UF-25V-10%-X5R(0805)  [C0805]
C1102  100nF  CERAMIC-100NF-50V-10%-X7R(0805)  [C0805]
C1103  100nF,  CERAMIC-100NF-50V-10%-X7R(0805)  [C0805]
C1104  100nF,  CERAMIC-100NF-50V-10%-X7R(0805)  [C0805]
C1105  100nF.  CERAMIC-100NF-50V-10%-X7R(0805)  [C0805]
C1106  100nF.  CERAMIC-100NF-50V-10%-X7R(0805)  [C0805]
C1107  100u  CERAMIC-100UF-6.3V-20%-X5R(1206)  [C1206]
C1108  100u  CERAMIC-100UF-6.3V-20%-X5R(1206)  [C1206]
C1109  2.2nF  CERAMIC-100NF-50V-10%-X7R(0805)  [C0805]
C1110  100nF  CERAMIC-100NF-50V-10%-X7R(0805)  [C0805]
D1101  SM6T  [DO214AA]
D1102  1N4007,  DIODE-GEN-PURPOSE-1KV-1A(DO-214AC)  [DO-214AC]
D1103  1N4007,  DIODE-GEN-PURPOSE-1KV-1A(DO-214AC)  [DO-214AC]
D1104  SM6TDO214AA_BI  [DO214AA_BI]
D1105  1N4007.  DIODE-GEN-PURPOSE-1KV-1A(DO-214AC)  [DO-214AC]
D1106  1N4007.  DIODE-GEN-PURPOSE-1KV-1A(DO-214AC)  [DO-214AC]
D1107  1N5817  DIODE-GEN-PURPOSE-1KV-1A(DO-214AC)DO-214AC/1206  [DO-214AC_SLIM]
D1108  1N5817.  DIODE-GEN-PURPOSE-1KV-1A(DO-214AC)DO-214AC/1206  [DO-214AC_SLIM]
D1109  1N5817.  DIODE-GEN-PURPOSE-1KV-1A(DO-214AC)DO-214AC/1206  [DO-214AC_SLIM]
D1110  1N5817  DIODE-GEN-PURPOSE-1KV-1A(DO-214AC)DO-214AC/1206  [DO-214AC_SLIM]
D1111  1N4007  DIODE-GEN-PURPOSE-1KV-1A(DO-214AC)  [DO-214AC]
D1112  1N4007  DIODE-GEN-PURPOSE-1KV-1A(DO-214AC)  [DO-214AC]
FID1101  FIDUCIAL  [FIDUCIAL_1MM]
FID1102  FIDUCIAL  [FIDUCIAL_1MM]
FID1103  FIDUCIAL  [FIDUCIAL_1MM]
FID1104  FIDUCIAL  [FIDUCIAL_1MM]
IC1101  LM2904  LM358D  [SO08]
IC1102  78L06  78LXXSOT89_ROUND  [SOT89_ROUND]
IC1103  6V pos  78LXX  [78LXX]
IC1104  78L10  78LXXSOT89_ROUND  [SOT89_ROUND]
IC1105  4028  4028D  [SO16]
IC1106  NUP4304SOT457_R  [SOT457R_PHILIPS]
IC1107  ULN2004  ULN2004AD  [SO16]
IC1108  LM339  LM339D  [SO14]
IC1109  317TO202H_NOHOLE  [TO220H_NOHOLE]
IC1110  555  NE555D  [SO08]
IC1111  4538  4538D  [SO16]
JP1101  JP2EJP2_SMALLPADS  [JP2_SMALLPADS]
JP1102  JP2EJP2_SMALLPADS  [JP2_SMALLPADS]
JP1103  JP2EJP2_SMALLPADS  [JP2_SMALLPADS]
JP1104  JP2EJP2_SMALLPADS  [JP2_SMALLPADS]
JP1105  JP2E_ORIG  [JP2_ORIG_SMALLPADS]
LED1101  LEDLD260  [LD260]
LED1102  LEDLD260  [LD260]
LED1103  LEDLD260  [LD260]
LED1104  LEDLD260  [LD260]
LED1105  LEDLD260  [LD260]
LED1106  LEDLD260  [LD260]
Q1101  BA.  PNP-TRANSISTOR_SOT89  [SOT89]
Q1102  BA.  PNP-TRANSISTOR_SOT89  [SOT89]
Q1103  MY  NPN-TRANSISTOR_SOT89  [SOT89]
Q1104  BA  PNP-TRANSISTOR_SOT89  [SOT89]
Q1105  BA  PNP-TRANSISTOR_SOT89  [SOT89]
Q1106  J1  SMD-MOSFET-N-CH-50V-200MA-BSS138W-7-F(SOT-23)  [SOT-23]
Q1107  J1  SMD-MOSFET-N-CH-50V-200MA-BSS138W-7-F(SOT-23)  [SOT-23]
R1101  102  SMD-RES-1K-5%-1/8W(0805)  [R0805]
R1102  13  SMD-RES-13R-5%-1/4W(1206)  [R1206]
R1103  R_user  R-EU_R0805  [R0805]
R1104  R_user  R-EU_R0805  [R0805]
R1105  4701  SMD-RES-4.7K-5%-1/8W(0805)  [R0805]
R1106  13  SMD-RES-13R-5%-1/4W(1206)  [R1206]
R1107  1002  SMD-RES-10K-1%-1/8W(0805)  [R0805]
R1108  1002  SMD-RES-10K-1%-1/8W(0805)  [R0805]
R1109  104.  SMD-RES-10K-1%-1/8W(0805)  [R0805]
R1110  104.  SMD-RES-10K-1%-1/8W(0805)  [R0805]
R1111  104.  SMD-RES-10K-1%-1/8W(0805)  [R0805]
R1112  102  SMD-RES-1K-5%-1/8W(0805)  [R0805]
R1113  102  SMD-RES-1K-5%-1/8W(0805)  [R0805]
R1114  102  SMD-RES-1K-5%-1/8W(0805)  [R0805]
R1115  100  SMD-RES-220R-5%-1/8W(0805)  [R0805]
R1116  4701  SMD-RES-4.7K-5%-1/8W(0805)  [R0805]
R1117  2702  SMD-RES-4.7K-5%-1/8W(0805)  [R0805]
R1118  13  SMD-RES-13R-5%-1/4W(1206)  [R1206]
R1119  2201  SMD-RES-2.2K-5%-1/8W(0805)  [R0805]
R1120  1002  SMD-RES-10K-1%-1/8W(0805)  [R0805]
R1121  1502  SMD-RES-10K-1%-1/8W(0805)  [R0805]
R1122  2702  SMD-RES-4.7K-5%-1/8W(0805)  [R0805]
R1123  2702  SMD-RES-4.7K-5%-1/8W(0805)  [R0805]
R1124  1002  SMD-RES-10K-1%-1/8W(0805)  [R0805]
R1125  104  SMD-RES-10K-1%-1/8W(0805)  [R0805]
R1126  4701  SMD-RES-4.7K-5%-1/8W(0805)  [R0805]
R1127  47  R-EU_V235/17_1MM  [V235/17_1MM]
R1128  102  SMD-RES-1K-5%-1/8W(0805)  [R0805]
R1129  47  R-EU_V235/17_1MM  [V235/17_1MM]
R1130  104  SMD-RES-10K-1%-1/8W(0805)  [R0805]
R1131  1502  SMD-RES-10K-1%-1/8W(0805)  [R0805]
R1132  1002  SMD-RES-10K-1%-1/8W(0805)  [R0805]
R1133  2201  SMD-RES-2.2K-5%-1/8W(0805)  [R0805]
R1134  13  SMD-RES-13R-5%-1/4W(1206)  [R1206]
R1135  104.  SMD-RES-10K-1%-1/8W(0805)  [R0805]
R1136  47  R-EU_V235/17_1MM  [V235/17_1MM]
R1137  47  R-EU_V235/17_1MM  [V235/17_1MM]
R1138  100  SMD-RES-2.2K-5%-1/8W(0805)  [R0805]
R1139  (101)  SMD-RES-2.2K-5%-1/8W(0805)  [R0805]
R1140  2702  SMD-RES-10K-1%-1/8W(0805)  [R0805]
R1141  104  SMD-RES-10K-1%-1/8W(0805)  [R0805]
R1142  (1000)  SMD-RES-100R-5%-1/8W(0805)  [R0805]
R1143  (101)  SMD-RES-100R-5%-1/8W(0805)  [R0805]
R1144  (1002)  SMD-RES-10K-1%-1/8W(0805)  [R0805]
R1145  2702  SMD-RES-4.7K-5%-1/8W(0805)  [R0805]
R1146  (1002)  SMD-RES-4.7K-5%-1/8W(0805)  [R0805]
SJ1101  SJ  [SJ]
START1101  TPSB2.0  [B2.0]
TP231  TPSB2.0  [B2.0]
TP232  TPSB2.0  [B2.0]
TP233  TPSB2.0  [B2.0]
TP234  TPSB2.0  [B2.0]
TP235  TPSB2.0  [B2.0]
TP236  TPSB2.0  [B2.0]
TP237  TPSB2.0  [B2.0]
TP238  TPSB2.0  [B2.0]
TP239  TPSB2.0  [B2.0]
TP240  TPSB2.0  [B2.0]
TP241  TPSB2.0  [B2.0]
TP242  TPSB2.0  [B2.0]
TP243  TPSB2.0  [B2.0]
TP244  TPSB2.0  [B2.0]
TP245  TPSB2.0  [B2.0]
TP246  TPSB2.0  [B2.0]
TP247  TPSB2.0  [B2.0]
TP248  TPSB2.0  [B2.0]
TP249  TPSB1,27  [B1,27]
TP250  TPSB2.0  [B2.0]
TP251  TPSB2.0  [B2.0]
TP252  TPSB2.0  [B2.0]
TP253  TPSB2.0  [B2.0]
X1101  CON_BMWV2  [24-PIN_V2]
X1102  22-23-2021  [22-23-2021]
X1103  22-23-2051  [22-23-2051]

### Nets
+10V: 10V1101.TP(PP) C1102.1 IC1104.1(OUT) IC1110.4(R) IC1110.8(V+) IC1111.3(A:CD) IC1111.5(A:B) IC1111.13(B:CD) IC1111.16(P:VDD) R1145.2 ; also sheet 1,2,3,4,5,6,7,8,9,10,12
+12V: 22.1 D1101.C IC1102.3(IN) IC1103.IN IC1104.3(IN) IC1105.16(VDD) IC1106.2(V+) IC1107.9(CD+) JP1101.2 Q1104.3(E) Q1105.3(E) R1102.1 R1106.1 R1109.2 R1110.2 R1111.2 R1129.2 R1135.1 TP252.TP(PP) X1101.6 X1103.1 ; also sheet 1,2,3,4,5,6,7,8,9,10,12
+12V11: IC1101.7(B:OUT) R1116.1 R1117.1
GND: 21.12 C1101.2 C1102.2 C1103.2 C1104.2 C1105.2 C1106.1 C1107.2 C1108.2 C1109.1 C1110.2 D1101.A D1104.A D1105.1(+) IC1101.4(P:V-) IC1102.2(GND) IC1102.2@1(GND) IC1103.GND IC1104.2(GND) IC1104.2@1(GND) IC1105.8(VSS) IC1105.11(D) IC1106.5(V-) IC1107.8(GND) IC1108.10(D:-IN) IC1108.11(D:+IN) IC1108.12(P:GND) IC1110.1(GND) IC1111.1(A:T1) IC1111.4(A:A) IC1111.8(P:VSS) IC1111.15(B:T1) Q1103.3(E) Q1106.2(S) Q1107.2(S) R1101.2 R1103.2 R1104.2 R1107.1 R1114.1 R1123.1 R1132.1 R1136.1 R1137.1 R1139.2 R1141.2 R1143.2 X1101.13 X1101.18 X1101.23 X1102.1 X1103.5 ; also sheet 1,2,3,4,5,6,7,8,9,10,12
N$984: R1127.2 R1129.1
N$985: 22.9 D1107.1(+) D1108.1(+) JP1102.1 JP1103.2 TP249.TP(PP)
N$986: IC1105.10(A) IC1106.1(D1) R1111.1 X1101.4 X1103.2
N$987: IC1105.13(B) IC1106.4(D4) R1110.1 X1101.3 X1103.3
N$988: D1105.2(-) Q1104.2(C) START1101.TP(PP) X1101.5
N$989: IC1105.12(C) IC1106.3(D3) R1109.1 X1101.2 X1103.4
N$990: 22.7 LED1101.A TP247.TP(PP) X1101.8
N$991: 22.2 D1109.2(-) LED1102.K(C) TP242.TP(PP) X1101.12
N$992: 22.3 D1108.2(-) LED1103.K(C) TP243.TP(PP) X1101.11
N$993: 22.4 D1107.2(-) LED1104.K(C) TP244.TP(PP) X1101.10
N$994: 22.8 D1110.2(-) LED1106.K(C) TP248.TP(PP) X1101.14
N$995: 21.9 D1102.1(+) TP239.TP(PP) X1101.17
N$996: 21.11 D1103.1(+) TP241.TP(PP) X1101.19
N$997: D1104.C R1105.2 X1101.22
N$998: C1101.1 IC1101.3(A:+IN) R1105.1
N$999: 22.11 IC1107.16(O1) R1118.2 R1119.1 TP251.TP(PP)
N$1000: IC1108.1(B:OUT) R1124.2 R1125.2
N$1001: C1107.1 R1125.1 R1130.2
N$1002: C1108.1 IC1108.4(A:-IN) R1130.1
N$1003: IC1108.5(A:+IN) R1131.1 R1132.2 R1133.2
N$1004: D1111.1(+) R1133.1
N$1005: C1105.1 IC1108.9(C:+IN) R1122.2 R1123.2
N$1006: C1106.2 IC1108.14(C:OUT) R1126.2
N$1007: Q1105.1(B) R1126.1
N$1008: IC1105.2(Q2) IC1107.7(I7)
N$1009: 21.5 IC1107.12(O5) TP235.TP(PP)
N$1010: IC1105.1(Q4) IC1107.4(I4)
N$1011: 21.8 Q1106.3(D) TP238.TP(PP)
N$1012: 22.10 TP250.TP(PP) X1101.15
N$1013: 22.5 D1106.2(-) LED1105.K(C) TP245.TP(PP) X1101.9
N$1014: D1106.1(+) R1127.1
N$1015: IC1105.6(Q5) IC1107.3(I3)
N$1016: 21.4 IC1107.10(O7) TP234.TP(PP)
N$1017: IC1109.1(ADJ) R1120.2 R1134.1 X1101.7
N$1018: IC1108.6(B:-IN) IC1108.8(C:-IN) R1120.1
N$1019: 21.2 Q1101.2(C) TP232.TP(PP)
N$1020: 21.1 TP231.TP(PP) X1101.1
N$1034: R1140.2 X1101.16
N$1035: IC1105.15(Q3) IC1107.5(I5)
N$1036: 21.6 IC1107.13(O4) TP236.TP(PP)
N$1037: 21.7 IC1107.14(O3) TP237.TP(PP)
N$1038: 22.6 JP1105.2 TP246.TP(PP)
N$1039: LED1101.K(C) R1143.1
N$1040: LED1102.A LED1103.A LED1104.A LED1105.A LED1106.A R1142.1
N$1041: Q1104.1(B) R1128.2
N$1042: IC1105.3(Q0) IC1107.1(I1) IC1107.2(I2) Q1106.1(G)
N$1043: IC1105.14(Q1) IC1107.6(I6)
N$1044: 21.3 IC1107.11(O6) TP233.TP(PP)
N$1045: Q1101.1(B) Q1102.1(B) Q1102.2(C) R1101.1 R1103.1 R1104.1 X1102.2
N$1046: Q1101.3(E) R1102.2
N$1047: Q1102.3(E) R1106.2
N$1048: IC1108.7(B:+IN) R1121.1 R1122.1
N$1049: IC1101.2(A:-IN) R1107.2
N$1050: Q1103.1(B) R1116.2
N$1051: Q1107.3(D) R1138.2
N$1052: IC1109.2(VO) R1134.2
N$1053: IC1109.3(VI) Q1105.2(C)
N$1054: C1109.2 D1112.2(-) IC1106.6(D2) IC1110.2(TR) IC1110.6(THR) R1141.1
N$1055: IC1110.5(CV) R1144.2
N$1056: IC1110.3(Q) IC1111.12(B:A) R1144.1
N$1057: D1112.1(+) R1140.1
N$1058: 21.10 D1102.2(-) D1103.2(-) JP1104.1 SJ1101.1 TP240.TP(PP)
N$1059: JP1104.2 R1136.2 R1137.2 SJ1101.2
N$1060: IC1111.9(B:!Q) IC1111.11(B:B) R1146.2
N$1061: C1110.1 IC1111.14(B:T2) R1145.1
N$1062: JP1101.1 R1119.2
N$1063: IC1107.15(O2) R1128.1
N$1064: 22.12 R1146.1 TP253.TP(PP)
N$1065: D1109.1(+) JP1102.2
N$1066: D1111.2(-) IC1108.2(A:OUT) JP1105.1 Q1107.1(G) R1135.2
N$1067: IC1101.1(A:OUT) R1108.2
N$1068: C1103.1 R1108.1 R1112.1
N$1069: IC1101.5(B:+IN) R1112.2 R1117.2
N$1070: IC1101.6(B:-IN) R1113.1 R1114.2
N$1071: D1110.1(+) JP1103.1
N$1072: JP1105.3 R1138.1 R1139.1
N$1073: IC1108.13(D:OUT)
N$1074: R1115.1 X1101.21
N$1075: Q1103.2(C) R1115.2 R1118.1
VCC: 6V1101.TP(PP) C1104.1 IC1101.8(P:V+) IC1102.1(OUT) IC1103.OUT IC1108.3(P:V+) R1113.2 R1121.2 R1124.1 R1131.2 R1142.2 ; also sheet 1,2,3,4,5,6,7,8,9,10,12
Unconnected: IC1105.4(Q7) IC1105.5(Q9) IC1105.7(Q6) IC1105.9(Q8) IC1110.7(DIS) IC1111.2(A:T2) IC1111.6(A:Q) IC1111.7(A:!Q) IC1111.10(B:Q) X1101.20 X1101.24

### Notes on the sheet
- Externe Beschaltung
- Variante "eine LED leuchtet"
- Variante "alle LEDs bis und
   mit Gang X leuchten"
- Anzeige:
- Klemmleisten
  Ausgang:
- Gang 1
- DauerPlus
  Konstant-Strom für LEDs
  Gang 1
  Gang 2
  Gang 3
  Gang 4
  Gang 5
  Neutrallampe
  Blinker rechts
  Blinker zusammen
  Blinker links
  Masse
- Gang 1
- Gang 2
- Gang 2
- Gang 3
- Gang 3
- Gang 1 | Gang 2 | Gang 3 | Gang 4 | Gang 5
- Gang 4
- Gang 4 | Klemmleisten Ausgang:
- Gang 5
- Gang 5
- Zündugsplus
  Choke
  Öldrucklampe
  Temperaturlampe
  Ladekontrolllampe
  Tankgeber (100hm)
  ABS-Lampe
  Lampentest
  Warnlampe
  Fernlichtlampe
  Geschwindigkeitssignal
  Menütaster
- Stromquelle für Gang
  LEDs. Für mehr als 12mA
  muss ein Widerstand "R_user"
  eingelötet werden. Für weniger
  muss der 1kOhm SMD Widerstand
  neben R_user entfernt werden
  I = 12V/1kOhm(default)+12V/R_user
  I= 12mA (default) + 12V/R_user
  Beispiel:
  R_user      Strom in LEDs
  1 kOhm     22-26mA
  ohne       11-13mA
- Externe Beschaltung
- an Zündungsplus anhängen
  (Neutral leuchtet wenn Gang 0
  eingelegt und Zündschlüssel steckt )
- Neutrallampe
  für eigene
  Ganganzeige
- DauerPlus Batterie 12V (rot weiss)
  Ganganzeige Signal C (gelb weiss)
  Ganganzeige Signal B (gelb schwarz)
  Ganganzeige Signal A (gelb dunkelblau)
  12V/350mA zum Starknopf (schwarz grün)
  Zündungsplus 12V (grün schwarz)
  Reservelampe (weiss)
  ABS Leuchte (blau)
  Ladekontrollleuchte (schaltet auf Masse) (violett schwarz)
  Temperaturleuchte (schaltet auf Masse) (braun schwarz)
  Öldruckleuchte (schaltet auf Masse) (braun grün)
  Chokelampe (schaltet auf Masse) (violett weiss)
- BL resistors
- 1k
- an Ausgang "Neutrallampe" anhängen
- Masse (braun)
  Lampentest (schaltet auf Masse)(weiss blau)
  Fernlichtlampe (12V) (weiss)
  Drehzahl Zündspule (schwarz blau)
  Blinker rechts (blau scharz)
  Masse (braun)
  Blinker links (blau rot)
  nicht angeschlossen
  Tachosiganl zum Blinrelais (balu grün)
  Tachogeber (gelb)
  Masse Tachobeger (braun)
  Tachobeleuchtung (12V Zündungsplus) (grau blau)
- RES | BAR
- 4.7V | rising edge trigger A
- ZündungsPlus
- current source 96mA
- 6V regulated for Opamps
- nicht bestückt

## Sheet 12 of 12
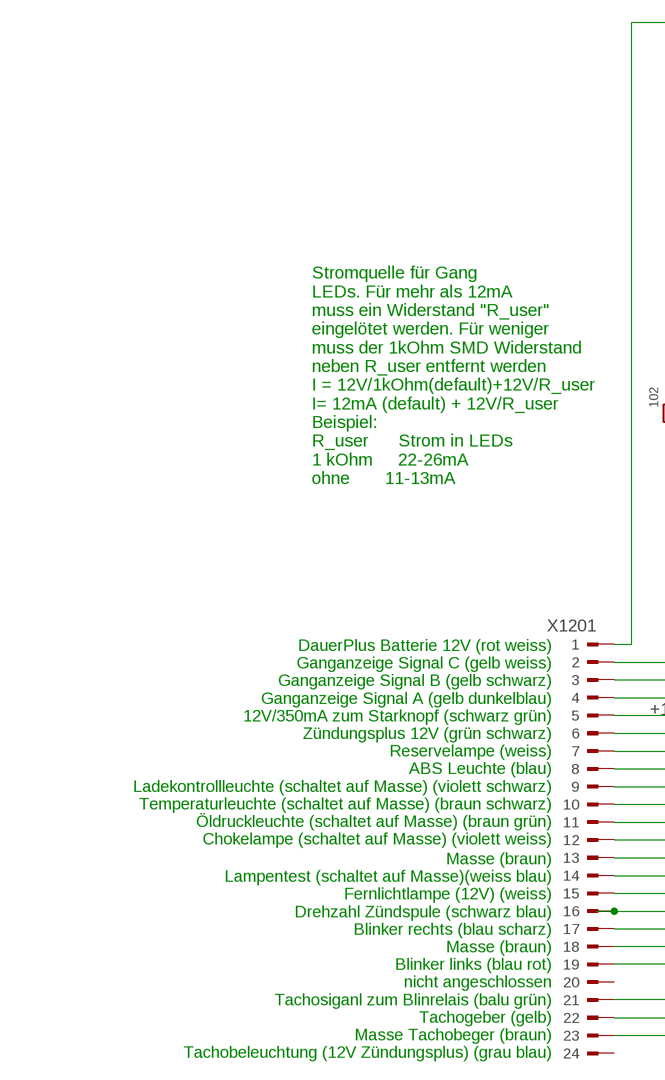
[diagram p22: schematic, sheet 12, part 1 of 2]
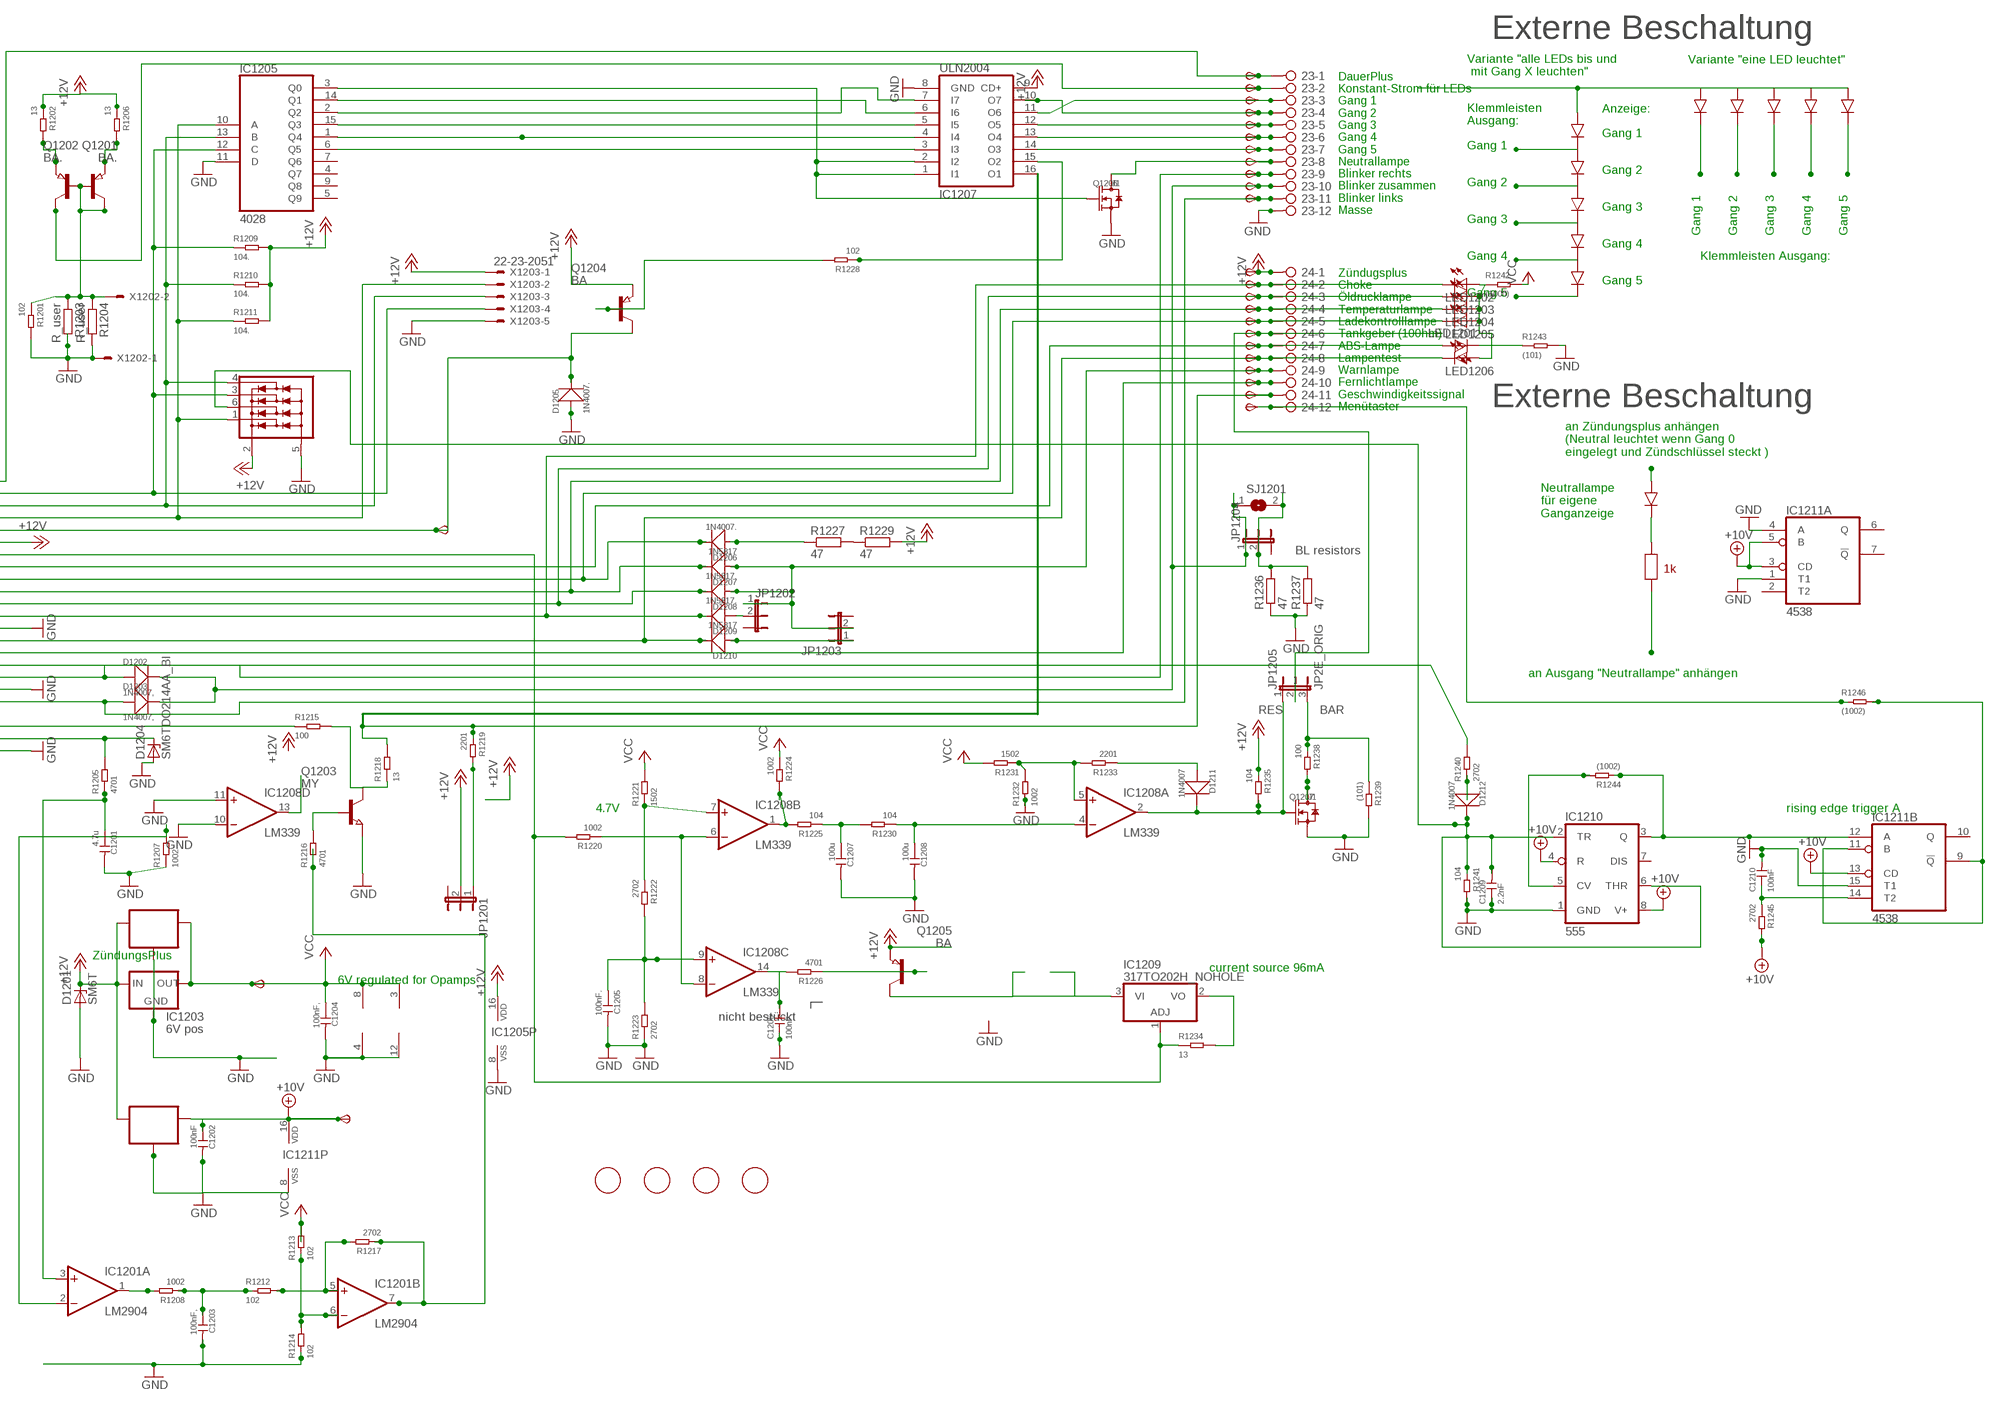
[diagram p23: schematic, sheet 12, part 2 of 2]

### Parts
6V1201  TPSB2.0  [B2.0]
10V1201  TPSB2.0  [B2.0]
23  2081-1132  [12-PIN]
24  2081-1132  [12-PIN]
C1201  4.7u  CERAMIC-4.7UF-25V-10%-X5R(0805)  [C0805]
C1202  100nF  CERAMIC-100NF-50V-10%-X7R(0805)  [C0805]
C1203  100nF,  CERAMIC-100NF-50V-10%-X7R(0805)  [C0805]
C1204  100nF,  CERAMIC-100NF-50V-10%-X7R(0805)  [C0805]
C1205  100nF.  CERAMIC-100NF-50V-10%-X7R(0805)  [C0805]
C1206  100nF.  CERAMIC-100NF-50V-10%-X7R(0805)  [C0805]
C1207  100u  CERAMIC-100UF-6.3V-20%-X5R(1206)  [C1206]
C1208  100u  CERAMIC-100UF-6.3V-20%-X5R(1206)  [C1206]
C1209  2.2nF  CERAMIC-100NF-50V-10%-X7R(0805)  [C0805]
C1210  100nF  CERAMIC-100NF-50V-10%-X7R(0805)  [C0805]
D1201  SM6T  [DO214AA]
D1202  1N4007,  DIODE-GEN-PURPOSE-1KV-1A(DO-214AC)  [DO-214AC]
D1203  1N4007,  DIODE-GEN-PURPOSE-1KV-1A(DO-214AC)  [DO-214AC]
D1204  SM6TDO214AA_BI  [DO214AA_BI]
D1205  1N4007.  DIODE-GEN-PURPOSE-1KV-1A(DO-214AC)  [DO-214AC]
D1206  1N4007.  DIODE-GEN-PURPOSE-1KV-1A(DO-214AC)  [DO-214AC]
D1207  1N5817  DIODE-GEN-PURPOSE-1KV-1A(DO-214AC)DO-214AC/1206  [DO-214AC_SLIM]
D1208  1N5817.  DIODE-GEN-PURPOSE-1KV-1A(DO-214AC)DO-214AC/1206  [DO-214AC_SLIM]
D1209  1N5817.  DIODE-GEN-PURPOSE-1KV-1A(DO-214AC)DO-214AC/1206  [DO-214AC_SLIM]
D1210  1N5817  DIODE-GEN-PURPOSE-1KV-1A(DO-214AC)DO-214AC/1206  [DO-214AC_SLIM]
D1211  1N4007  DIODE-GEN-PURPOSE-1KV-1A(DO-214AC)  [DO-214AC]
D1212  1N4007  DIODE-GEN-PURPOSE-1KV-1A(DO-214AC)  [DO-214AC]
FID1201  FIDUCIAL  [FIDUCIAL_1MM]
FID1202  FIDUCIAL  [FIDUCIAL_1MM]
FID1203  FIDUCIAL  [FIDUCIAL_1MM]
FID1204  FIDUCIAL  [FIDUCIAL_1MM]
IC1201  LM2904  LM358D  [SO08]
IC1202  78L06  78LXXSOT89_ROUND  [SOT89_ROUND]
IC1203  6V pos  78LXX  [78LXX]
IC1204  78L10  78LXXSOT89_ROUND  [SOT89_ROUND]
IC1205  4028  4028D  [SO16]
IC1206  NUP4304SOT457_R  [SOT457R_PHILIPS]
IC1207  ULN2004  ULN2004AD  [SO16]
IC1208  LM339  LM339D  [SO14]
IC1209  317TO202H_NOHOLE  [TO220H_NOHOLE]
IC1210  555  NE555D  [SO08]
IC1211  4538  4538D  [SO16]
JP1201  JP2EJP2_SMALLPADS  [JP2_SMALLPADS]
JP1202  JP2EJP2_SMALLPADS  [JP2_SMALLPADS]
JP1203  JP2EJP2_SMALLPADS  [JP2_SMALLPADS]
JP1204  JP2EJP2_SMALLPADS  [JP2_SMALLPADS]
JP1205  JP2E_ORIG  [JP2_ORIG_SMALLPADS]
LED1201  LEDLD260  [LD260]
LED1202  LEDLD260  [LD260]
LED1203  LEDLD260  [LD260]
LED1204  LEDLD260  [LD260]
LED1205  LEDLD260  [LD260]
LED1206  LEDLD260  [LD260]
Q1201  BA.  PNP-TRANSISTOR_SOT89  [SOT89]
Q1202  BA.  PNP-TRANSISTOR_SOT89  [SOT89]
Q1203  MY  NPN-TRANSISTOR_SOT89  [SOT89]
Q1204  BA  PNP-TRANSISTOR_SOT89  [SOT89]
Q1205  BA  PNP-TRANSISTOR_SOT89  [SOT89]
Q1206  J1  SMD-MOSFET-N-CH-50V-200MA-BSS138W-7-F(SOT-23)  [SOT-23]
Q1207  J1  SMD-MOSFET-N-CH-50V-200MA-BSS138W-7-F(SOT-23)  [SOT-23]
R1201  102  SMD-RES-1K-5%-1/8W(0805)  [R0805]
R1202  13  SMD-RES-13R-5%-1/4W(1206)  [R1206]
R1203  R_user  R-EU_R0805  [R0805]
R1204  R_user  R-EU_R0805  [R0805]
R1205  4701  SMD-RES-4.7K-5%-1/8W(0805)  [R0805]
R1206  13  SMD-RES-13R-5%-1/4W(1206)  [R1206]
R1207  1002  SMD-RES-10K-1%-1/8W(0805)  [R0805]
R1208  1002  SMD-RES-10K-1%-1/8W(0805)  [R0805]
R1209  104.  SMD-RES-10K-1%-1/8W(0805)  [R0805]
R1210  104.  SMD-RES-10K-1%-1/8W(0805)  [R0805]
R1211  104.  SMD-RES-10K-1%-1/8W(0805)  [R0805]
R1212  102  SMD-RES-1K-5%-1/8W(0805)  [R0805]
R1213  102  SMD-RES-1K-5%-1/8W(0805)  [R0805]
R1214  102  SMD-RES-1K-5%-1/8W(0805)  [R0805]
R1215  100  SMD-RES-220R-5%-1/8W(0805)  [R0805]
R1216  4701  SMD-RES-4.7K-5%-1/8W(0805)  [R0805]
R1217  2702  SMD-RES-4.7K-5%-1/8W(0805)  [R0805]
R1218  13  SMD-RES-13R-5%-1/4W(1206)  [R1206]
R1219  2201  SMD-RES-2.2K-5%-1/8W(0805)  [R0805]
R1220  1002  SMD-RES-10K-1%-1/8W(0805)  [R0805]
R1221  1502  SMD-RES-10K-1%-1/8W(0805)  [R0805]
R1222  2702  SMD-RES-4.7K-5%-1/8W(0805)  [R0805]
R1223  2702  SMD-RES-4.7K-5%-1/8W(0805)  [R0805]
R1224  1002  SMD-RES-10K-1%-1/8W(0805)  [R0805]
R1225  104  SMD-RES-10K-1%-1/8W(0805)  [R0805]
R1226  4701  SMD-RES-4.7K-5%-1/8W(0805)  [R0805]
R1227  47  R-EU_V235/17_1MM  [V235/17_1MM]
R1228  102  SMD-RES-1K-5%-1/8W(0805)  [R0805]
R1229  47  R-EU_V235/17_1MM  [V235/17_1MM]
R1230  104  SMD-RES-10K-1%-1/8W(0805)  [R0805]
R1231  1502  SMD-RES-10K-1%-1/8W(0805)  [R0805]
R1232  1002  SMD-RES-10K-1%-1/8W(0805)  [R0805]
R1233  2201  SMD-RES-2.2K-5%-1/8W(0805)  [R0805]
R1234  13  SMD-RES-13R-5%-1/4W(1206)  [R1206]
R1235  104  SMD-RES-10K-1%-1/8W(0805)  [R0805]
R1236  47  R-EU_V235/17_1MM  [V235/17_1MM]
R1237  47  R-EU_V235/17_1MM  [V235/17_1MM]
R1238  100  SMD-RES-2.2K-5%-1/8W(0805)  [R0805]
R1239  (101)  SMD-RES-2.2K-5%-1/8W(0805)  [R0805]
R1240  2702  SMD-RES-10K-1%-1/8W(0805)  [R0805]
R1241  104  SMD-RES-10K-1%-1/8W(0805)  [R0805]
R1242  (1000)  SMD-RES-100R-5%-1/8W(0805)  [R0805]
R1243  (101)  SMD-RES-100R-5%-1/8W(0805)  [R0805]
R1244  (1002)  SMD-RES-10K-1%-1/8W(0805)  [R0805]
R1245  2702  SMD-RES-4.7K-5%-1/8W(0805)  [R0805]
R1246  (1002)  SMD-RES-4.7K-5%-1/8W(0805)  [R0805]
SJ1201  SJ  [SJ]
START1201  TPSB2.0  [B2.0]
TP254  TPSB2.0  [B2.0]
TP255  TPSB2.0  [B2.0]
TP256  TPSB2.0  [B2.0]
TP257  TPSB2.0  [B2.0]
TP258  TPSB2.0  [B2.0]
TP259  TPSB2.0  [B2.0]
TP260  TPSB2.0  [B2.0]
TP261  TPSB2.0  [B2.0]
TP262  TPSB2.0  [B2.0]
TP263  TPSB2.0  [B2.0]
TP264  TPSB2.0  [B2.0]
TP265  TPSB2.0  [B2.0]
TP266  TPSB2.0  [B2.0]
TP267  TPSB2.0  [B2.0]
TP268  TPSB2.0  [B2.0]
TP269  TPSB2.0  [B2.0]
TP270  TPSB2.0  [B2.0]
TP271  TPSB2.0  [B2.0]
TP272  TPSB1,27  [B1,27]
TP273  TPSB2.0  [B2.0]
TP274  TPSB2.0  [B2.0]
TP275  TPSB2.0  [B2.0]
TP276  TPSB2.0  [B2.0]
X1201  CON_BMWV2  [24-PIN_V2]
X1202  22-23-2021  [22-23-2021]
X1203  22-23-2051  [22-23-2051]

### Nets
+10V: 10V1201.TP(PP) C1202.1 IC1204.1(OUT) IC1210.4(R) IC1210.8(V+) IC1211.3(A:CD) IC1211.5(A:B) IC1211.13(B:CD) IC1211.16(P:VDD) R1245.2 ; also sheet 1,2,3,4,5,6,7,8,9,10,11
+12V: 24.1 D1201.C IC1202.3(IN) IC1203.IN IC1204.3(IN) IC1205.16(VDD) IC1206.2(V+) IC1207.9(CD+) JP1201.2 Q1204.3(E) Q1205.3(E) R1202.1 R1206.1 R1209.2 R1210.2 R1211.2 R1229.2 R1235.1 TP275.TP(PP) X1201.6 X1203.1 ; also sheet 1,2,3,4,5,6,7,8,9,10,11
+12V12: IC1201.7(B:OUT) R1216.1 R1217.1
GND: 23.12 C1201.2 C1202.2 C1203.2 C1204.2 C1205.2 C1206.1 C1207.2 C1208.2 C1209.1 C1210.2 D1201.A D1204.A D1205.1(+) IC1201.4(P:V-) IC1202.2(GND) IC1202.2@1(GND) IC1203.GND IC1204.2(GND) IC1204.2@1(GND) IC1205.8(VSS) IC1205.11(D) IC1206.5(V-) IC1207.8(GND) IC1208.10(D:-IN) IC1208.11(D:+IN) IC1208.12(P:GND) IC1210.1(GND) IC1211.1(A:T1) IC1211.4(A:A) IC1211.8(P:VSS) IC1211.15(B:T1) Q1203.3(E) Q1206.2(S) Q1207.2(S) R1201.2 R1203.2 R1204.2 R1207.1 R1214.1 R1223.1 R1232.1 R1236.1 R1237.1 R1239.2 R1241.2 R1243.2 X1201.13 X1201.18 X1201.23 X1202.1 X1203.5 ; also sheet 1,2,3,4,5,6,7,8,9,10,11
N$1076: R1227.2 R1229.1
N$1077: 24.9 D1207.1(+) D1208.1(+) JP1202.1 JP1203.2 TP272.TP(PP)
N$1078: IC1205.10(A) IC1206.1(D1) R1211.1 X1201.4 X1203.2
N$1079: IC1205.13(B) IC1206.4(D4) R1210.1 X1201.3 X1203.3
N$1080: D1205.2(-) Q1204.2(C) START1201.TP(PP) X1201.5
N$1081: IC1205.12(C) IC1206.3(D3) R1209.1 X1201.2 X1203.4
N$1082: 24.7 LED1201.A TP270.TP(PP) X1201.8
N$1083: 24.2 D1209.2(-) LED1202.K(C) TP265.TP(PP) X1201.12
N$1084: 24.3 D1208.2(-) LED1203.K(C) TP266.TP(PP) X1201.11
N$1085: 24.4 D1207.2(-) LED1204.K(C) TP267.TP(PP) X1201.10
N$1086: 24.8 D1210.2(-) LED1206.K(C) TP271.TP(PP) X1201.14
N$1087: 23.9 D1202.1(+) TP262.TP(PP) X1201.17
N$1088: 23.11 D1203.1(+) TP264.TP(PP) X1201.19
N$1089: D1204.C R1205.2 X1201.22
N$1090: C1201.1 IC1201.3(A:+IN) R1205.1
N$1091: 24.11 IC1207.16(O1) R1218.2 R1219.1 TP274.TP(PP)
N$1092: IC1208.1(B:OUT) R1224.2 R1225.2
N$1093: C1207.1 R1225.1 R1230.2
N$1094: C1208.1 IC1208.4(A:-IN) R1230.1
N$1095: IC1208.5(A:+IN) R1231.1 R1232.2 R1233.2
N$1096: D1211.1(+) R1233.1
N$1097: C1205.1 IC1208.9(C:+IN) R1222.2 R1223.2
N$1098: C1206.2 IC1208.14(C:OUT) R1226.2
N$1099: Q1205.1(B) R1226.1
N$1100: IC1205.2(Q2) IC1207.7(I7)
N$1101: 23.5 IC1207.12(O5) TP258.TP(PP)
N$1102: IC1205.1(Q4) IC1207.4(I4)
N$1103: 23.8 Q1206.3(D) TP261.TP(PP)
N$1104: 24.10 TP273.TP(PP) X1201.15
N$1105: 24.5 D1206.2(-) LED1205.K(C) TP268.TP(PP) X1201.9
N$1106: D1206.1(+) R1227.1
N$1107: IC1205.6(Q5) IC1207.3(I3)
N$1108: 23.4 IC1207.10(O7) TP257.TP(PP)
N$1109: IC1209.1(ADJ) R1220.2 R1234.1 X1201.7
N$1110: IC1208.6(B:-IN) IC1208.8(C:-IN) R1220.1
N$1111: 23.2 Q1201.2(C) TP255.TP(PP)
N$1112: 23.1 TP254.TP(PP) X1201.1
N$1126: R1240.2 X1201.16
N$1127: IC1205.15(Q3) IC1207.5(I5)
N$1128: 23.6 IC1207.13(O4) TP259.TP(PP)
N$1129: 23.7 IC1207.14(O3) TP260.TP(PP)
N$1130: 24.6 JP1205.2 TP269.TP(PP)
N$1131: LED1201.K(C) R1243.1
N$1132: LED1202.A LED1203.A LED1204.A LED1205.A LED1206.A R1242.1
N$1133: Q1204.1(B) R1228.2
N$1134: IC1205.3(Q0) IC1207.1(I1) IC1207.2(I2) Q1206.1(G)
N$1135: IC1205.14(Q1) IC1207.6(I6)
N$1136: 23.3 IC1207.11(O6) TP256.TP(PP)
N$1137: Q1201.1(B) Q1202.1(B) Q1202.2(C) R1201.1 R1203.1 R1204.1 X1202.2
N$1138: Q1201.3(E) R1202.2
N$1139: Q1202.3(E) R1206.2
N$1140: IC1208.7(B:+IN) R1221.1 R1222.1
N$1141: IC1201.2(A:-IN) R1207.2
N$1142: Q1203.1(B) R1216.2
N$1143: Q1207.3(D) R1238.2
N$1144: IC1209.2(VO) R1234.2
N$1145: IC1209.3(VI) Q1205.2(C)
N$1146: C1209.2 D1212.2(-) IC1206.6(D2) IC1210.2(TR) IC1210.6(THR) R1241.1
N$1147: IC1210.5(CV) R1244.2
N$1148: IC1210.3(Q) IC1211.12(B:A) R1244.1
N$1149: D1212.1(+) R1240.1
N$1150: 23.10 D1202.2(-) D1203.2(-) JP1204.1 SJ1201.1 TP263.TP(PP)
N$1151: JP1204.2 R1236.2 R1237.2 SJ1201.2
N$1152: IC1211.9(B:!Q) IC1211.11(B:B) R1246.2
N$1153: C1210.1 IC1211.14(B:T2) R1245.1
N$1154: JP1201.1 R1219.2
N$1155: IC1207.15(O2) R1228.1
N$1156: 24.12 R1246.1 TP276.TP(PP)
N$1157: D1209.1(+) JP1202.2
N$1158: D1211.2(-) IC1208.2(A:OUT) JP1205.1 Q1207.1(G) R1235.2
N$1159: IC1201.1(A:OUT) R1208.2
N$1160: C1203.1 R1208.1 R1212.1
N$1161: IC1201.5(B:+IN) R1212.2 R1217.2
N$1162: IC1201.6(B:-IN) R1213.1 R1214.2
N$1163: D1210.1(+) JP1203.1
N$1164: JP1205.3 R1238.1 R1239.1
N$1165: IC1208.13(D:OUT)
N$1166: R1215.1 X1201.21
N$1167: Q1203.2(C) R1215.2 R1218.1
VCC: 6V1201.TP(PP) C1204.1 IC1201.8(P:V+) IC1202.1(OUT) IC1203.OUT IC1208.3(P:V+) R1213.2 R1221.2 R1224.1 R1231.2 R1242.2 ; also sheet 1,2,3,4,5,6,7,8,9,10,11
Unconnected: IC1205.4(Q7) IC1205.5(Q9) IC1205.7(Q6) IC1205.9(Q8) IC1210.7(DIS) IC1211.2(A:T2) IC1211.6(A:Q) IC1211.7(A:!Q) IC1211.10(B:Q) X1201.20 X1201.24

### Notes on the sheet
- Externe Beschaltung
- Variante "eine LED leuchtet"
- Variante "alle LEDs bis und
   mit Gang X leuchten"
- Anzeige:
- Klemmleisten
  Ausgang:
- Gang 1
- DauerPlus
  Konstant-Strom für LEDs
  Gang 1
  Gang 2
  Gang 3
  Gang 4
  Gang 5
  Neutrallampe
  Blinker rechts
  Blinker zusammen
  Blinker links
  Masse
- Gang 1
- Gang 2
- Gang 2
- Gang 3
- Gang 3
- Gang 1 | Gang 2 | Gang 3 | Gang 4 | Gang 5
- Gang 4
- Gang 4 | Klemmleisten Ausgang:
- Gang 5
- Gang 5
- Zündugsplus
  Choke
  Öldrucklampe
  Temperaturlampe
  Ladekontrolllampe
  Tankgeber (100hm)
  ABS-Lampe
  Lampentest
  Warnlampe
  Fernlichtlampe
  Geschwindigkeitssignal
  Menütaster
- Stromquelle für Gang
  LEDs. Für mehr als 12mA
  muss ein Widerstand "R_user"
  eingelötet werden. Für weniger
  muss der 1kOhm SMD Widerstand
  neben R_user entfernt werden
  I = 12V/1kOhm(default)+12V/R_user
  I= 12mA (default) + 12V/R_user
  Beispiel:
  R_user      Strom in LEDs
  1 kOhm     22-26mA
  ohne       11-13mA
- Externe Beschaltung
- an Zündungsplus anhängen
  (Neutral leuchtet wenn Gang 0
  eingelegt und Zündschlüssel steckt )
- Neutrallampe
  für eigene
  Ganganzeige
- DauerPlus Batterie 12V (rot weiss)
  Ganganzeige Signal C (gelb weiss)
  Ganganzeige Signal B (gelb schwarz)
  Ganganzeige Signal A (gelb dunkelblau)
  12V/350mA zum Starknopf (schwarz grün)
  Zündungsplus 12V (grün schwarz)
  Reservelampe (weiss)
  ABS Leuchte (blau)
  Ladekontrollleuchte (schaltet auf Masse) (violett schwarz)
  Temperaturleuchte (schaltet auf Masse) (braun schwarz)
  Öldruckleuchte (schaltet auf Masse) (braun grün)
  Chokelampe (schaltet auf Masse) (violett weiss)
- BL resistors
- 1k
- an Ausgang "Neutrallampe" anhängen
- Masse (braun)
  Lampentest (schaltet auf Masse)(weiss blau)
  Fernlichtlampe (12V) (weiss)
  Drehzahl Zündspule (schwarz blau)
  Blinker rechts (blau scharz)
  Masse (braun)
  Blinker links (blau rot)
  nicht angeschlossen
  Tachosiganl zum Blinrelais (balu grün)
  Tachogeber (gelb)
  Masse Tachobeger (braun)
  Tachobeleuchtung (12V Zündungsplus) (grau blau)
- RES | BAR
- 4.7V | rising edge trigger A
- ZündungsPlus
- current source 96mA
- 6V regulated for Opamps
- nicht bestückt